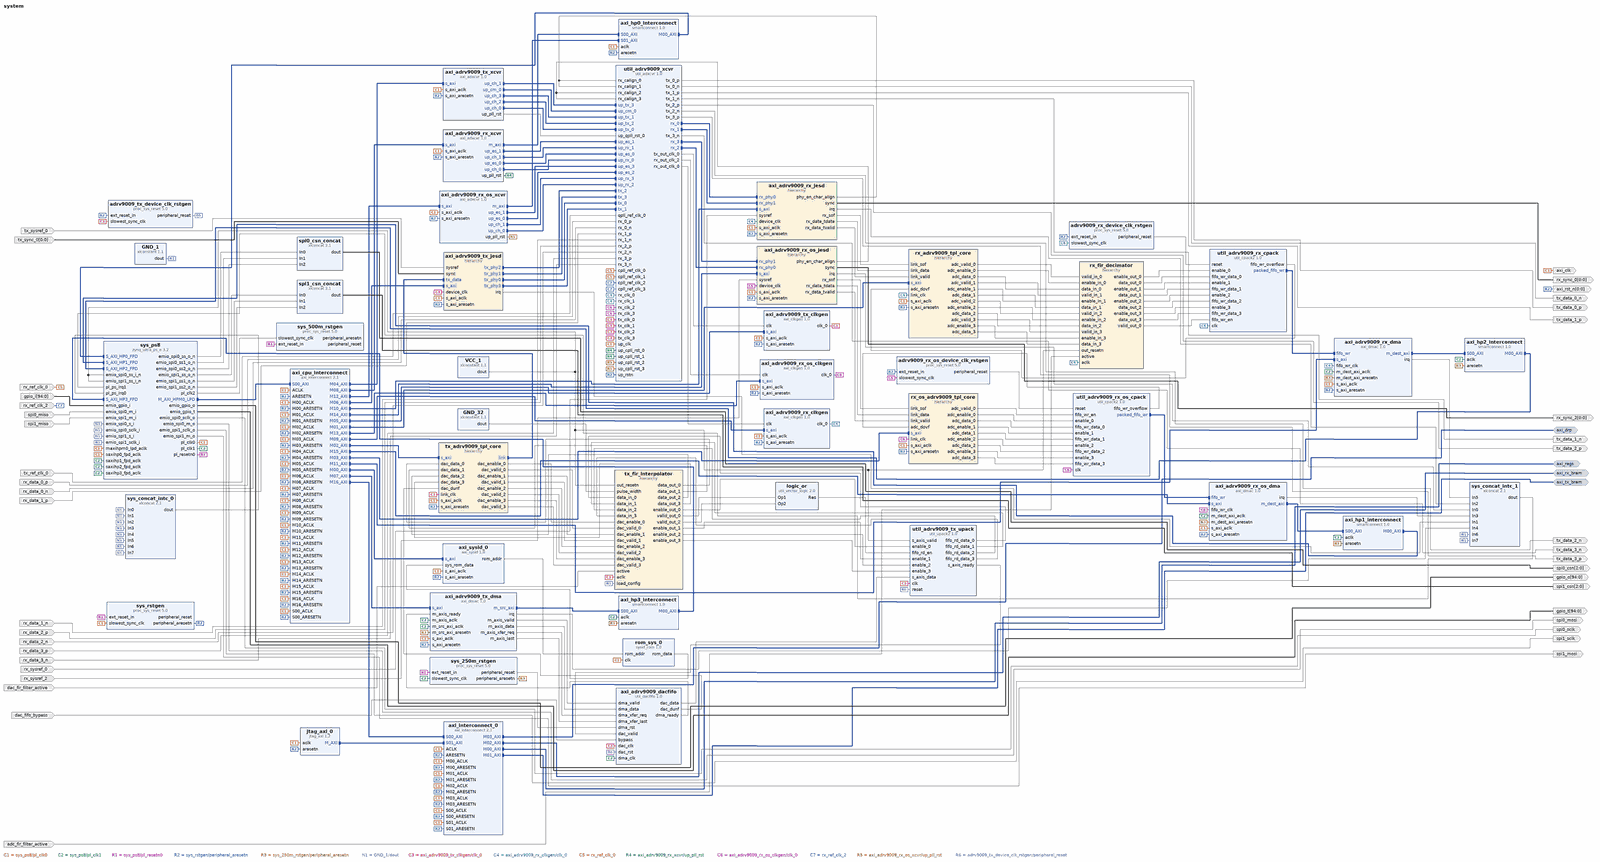
[diagram p0: block diagram of the top level, whole]
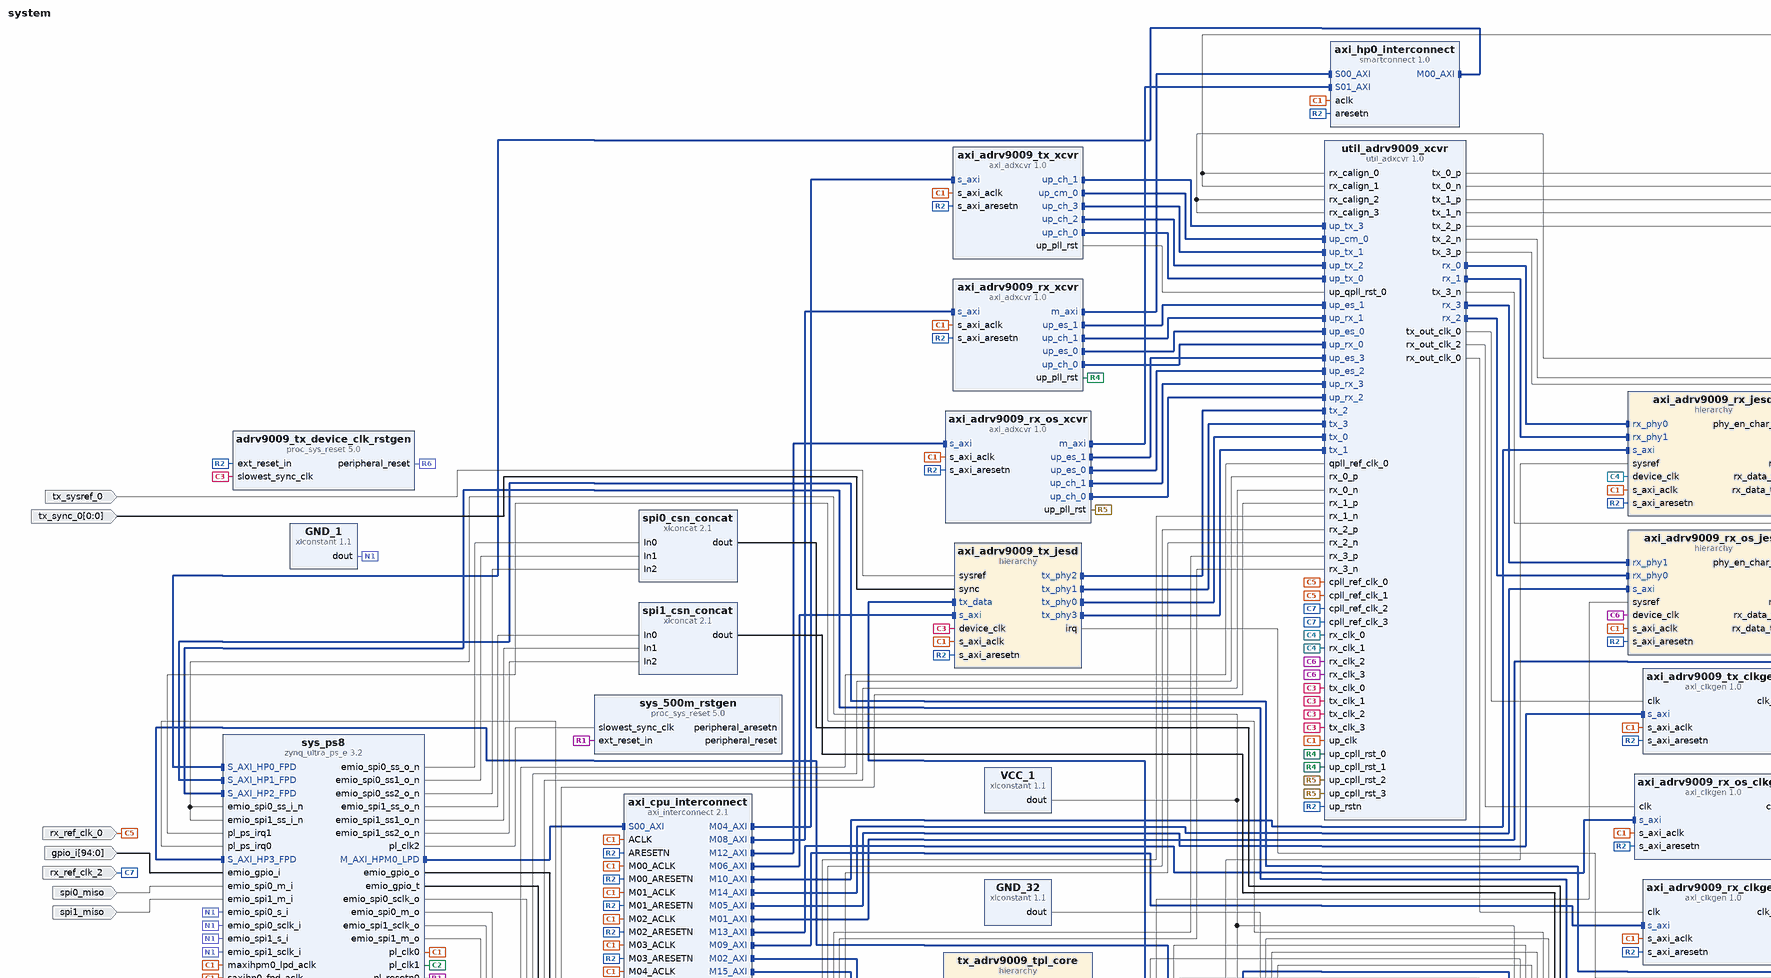
[diagram p1: block diagram of the top level, upper left part]
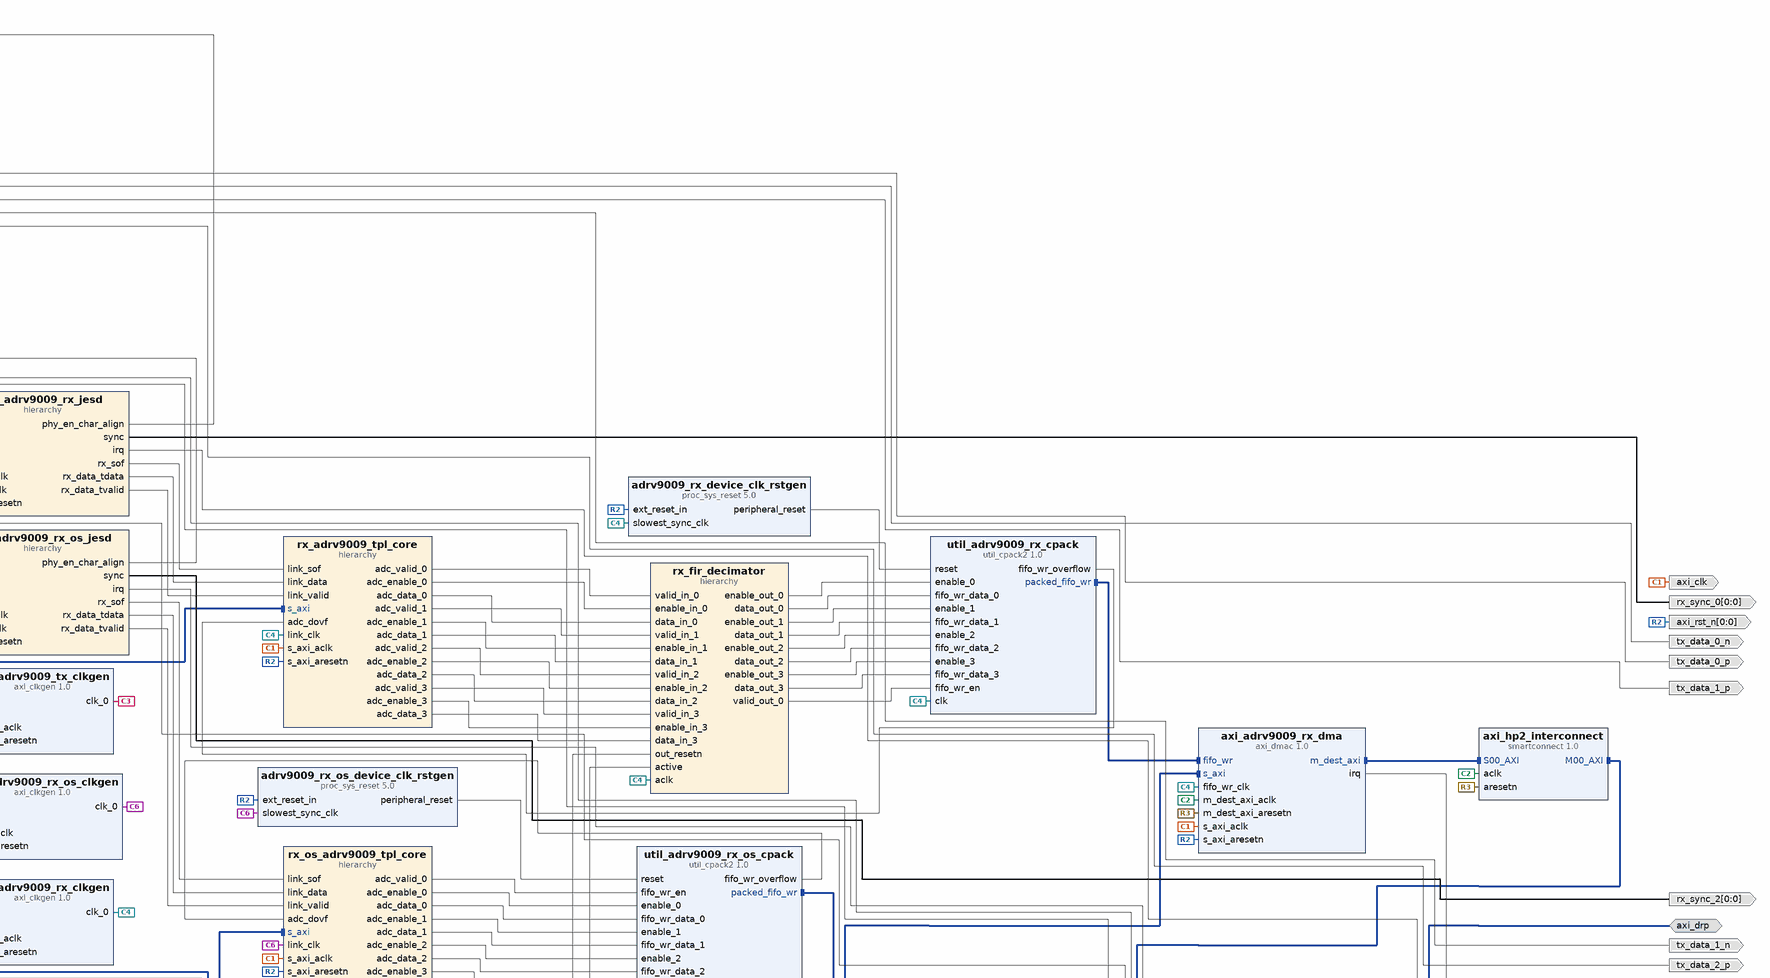
[diagram p2: block diagram of the top level, upper right part]
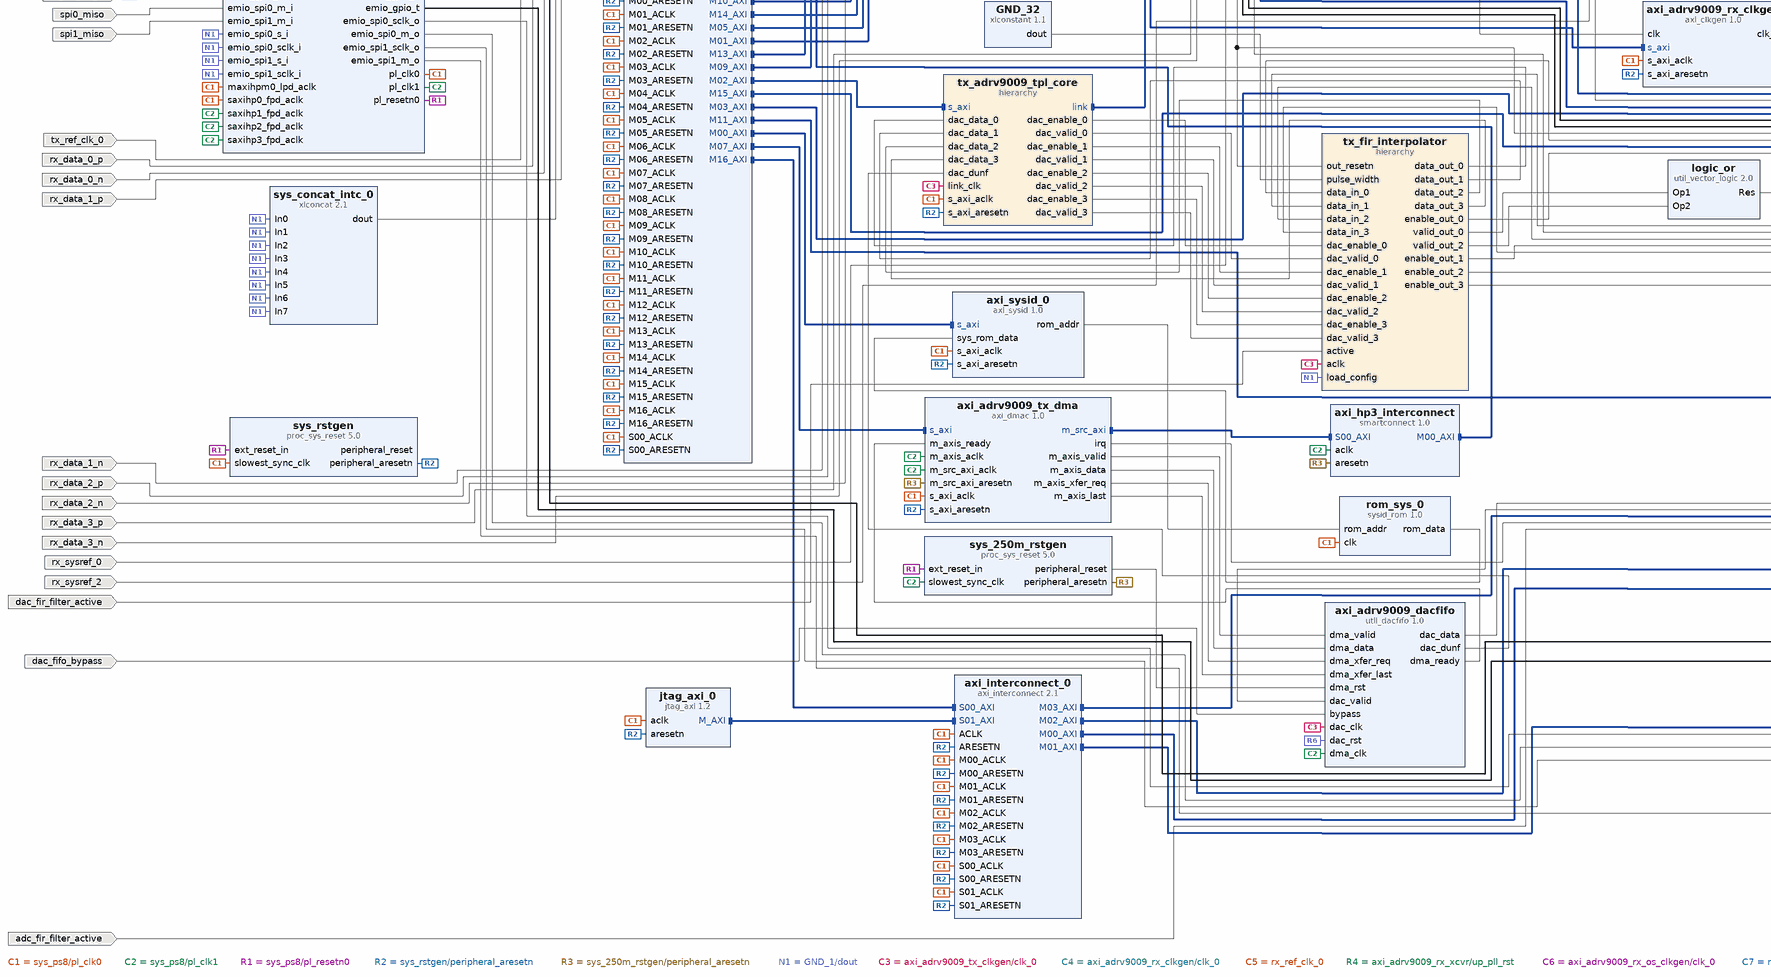
[diagram p3: block diagram of the top level, lower left part]
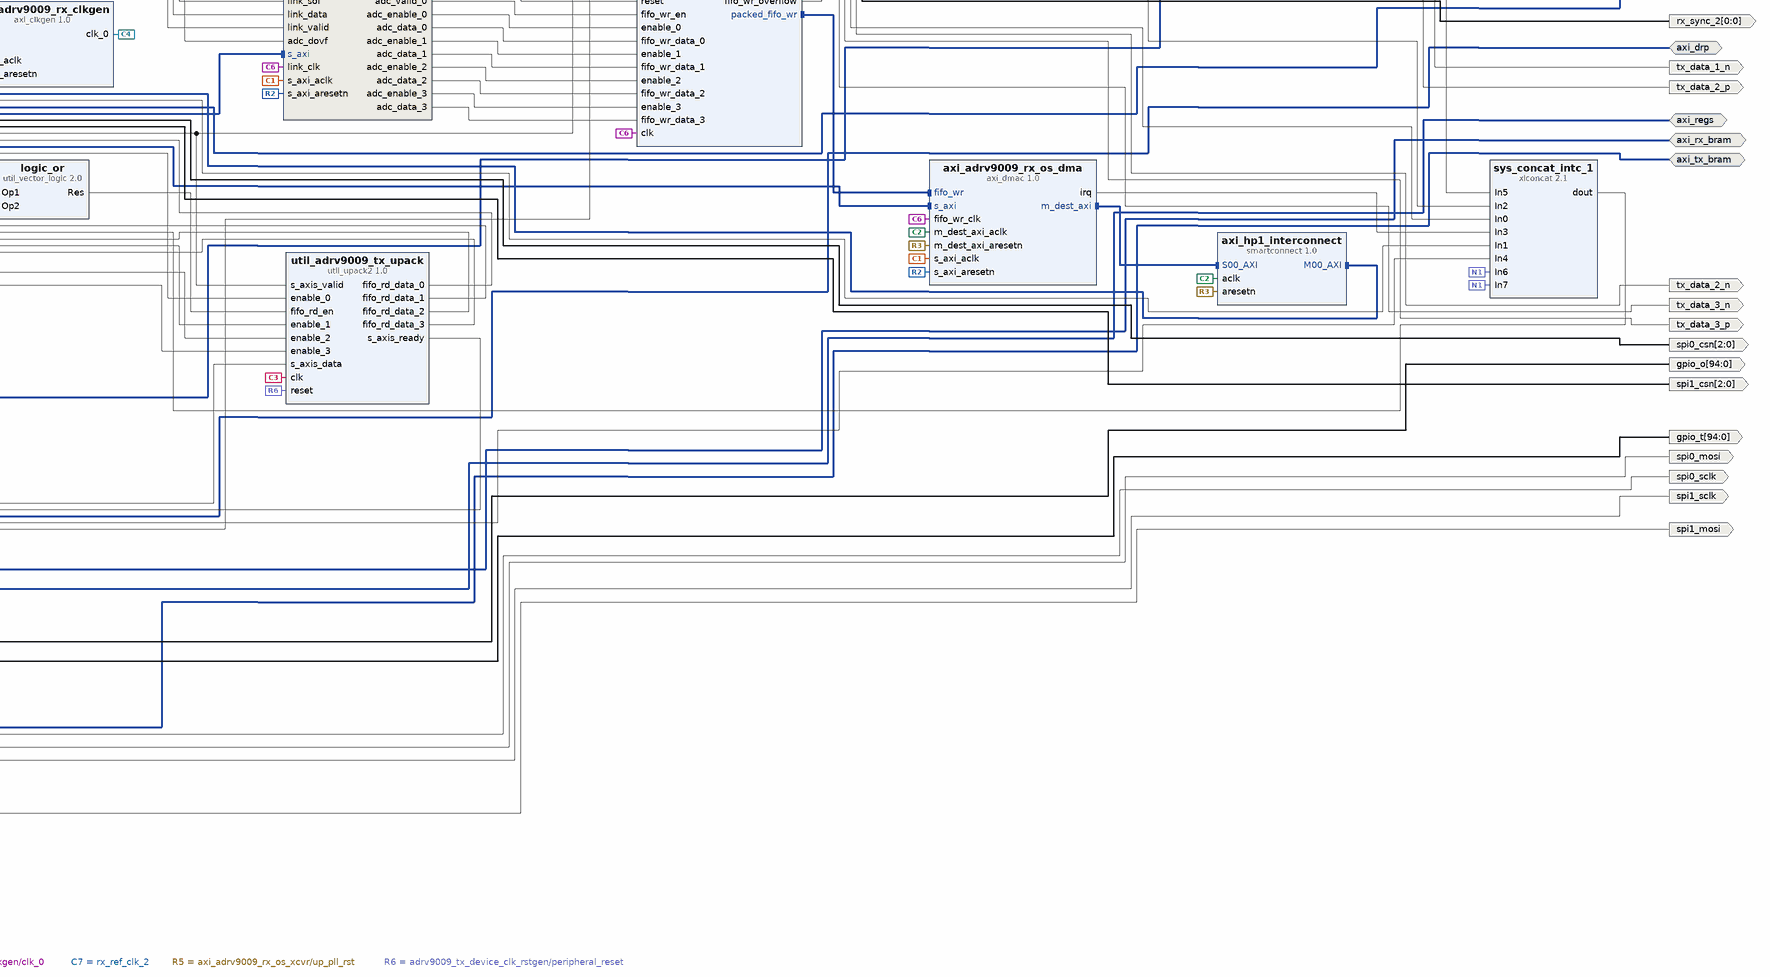
[diagram p4: block diagram of the top level, lower right part]
# Vivado block design system, xczu9eg-ffvb1156-2-e, Vivado 2018.3
create_bd_design system

create_bd_intf_port -mode Master -vlnv xilinx.com:interface:aximm_rtl:1.0 axi_tx_bram
set_property -dict [list \
  CONFIG.ADDR_WIDTH 32 \
  CONFIG.DATA_WIDTH 32 \
  CONFIG.NUM_READ_OUTSTANDING 2 \
  CONFIG.NUM_WRITE_OUTSTANDING 2 \
  CONFIG.PROTOCOL AXI4 \
] [get_bd_intf_ports axi_tx_bram]
create_bd_intf_port -mode Master -vlnv xilinx.com:interface:aximm_rtl:1.0 axi_rx_bram
set_property -dict [list \
  CONFIG.ADDR_WIDTH 32 \
  CONFIG.DATA_WIDTH 32 \
  CONFIG.NUM_READ_OUTSTANDING 2 \
  CONFIG.NUM_WRITE_OUTSTANDING 2 \
  CONFIG.PROTOCOL AXI4 \
] [get_bd_intf_ports axi_rx_bram]
create_bd_intf_port -mode Master -vlnv xilinx.com:interface:aximm_rtl:1.0 axi_regs
set_property -dict [list \
  CONFIG.ADDR_WIDTH 40 \
  CONFIG.DATA_WIDTH 32 \
  CONFIG.HAS_BURST 0 \
  CONFIG.HAS_CACHE 0 \
  CONFIG.HAS_LOCK 0 \
  CONFIG.HAS_QOS 0 \
  CONFIG.HAS_REGION 0 \
  CONFIG.NUM_READ_OUTSTANDING 2 \
  CONFIG.NUM_WRITE_OUTSTANDING 2 \
  CONFIG.PROTOCOL AXI4LITE \
] [get_bd_intf_ports axi_regs]
create_bd_intf_port -mode Master -vlnv xilinx.com:interface:aximm_rtl:1.0 axi_drp
set_property -dict [list \
  CONFIG.ADDR_WIDTH 40 \
  CONFIG.DATA_WIDTH 32 \
  CONFIG.HAS_BURST 0 \
  CONFIG.HAS_CACHE 0 \
  CONFIG.HAS_LOCK 0 \
  CONFIG.HAS_QOS 0 \
  CONFIG.HAS_REGION 0 \
  CONFIG.NUM_READ_OUTSTANDING 2 \
  CONFIG.NUM_WRITE_OUTSTANDING 2 \
  CONFIG.PROTOCOL AXI4LITE \
] [get_bd_intf_ports axi_drp]
create_bd_port -dir O -from 2 -to 0 spi0_csn
create_bd_port -dir O spi0_sclk
create_bd_port -dir O spi0_mosi
create_bd_port -dir I spi0_miso
create_bd_port -dir O -from 2 -to 0 spi1_csn
create_bd_port -dir O spi1_sclk
create_bd_port -dir O spi1_mosi
create_bd_port -dir I spi1_miso
create_bd_port -dir I -from 94 -to 0 gpio_i
create_bd_port -dir O -from 94 -to 0 gpio_o
create_bd_port -dir O -from 94 -to 0 gpio_t
create_bd_port -dir I dac_fifo_bypass
create_bd_port -dir I adc_fir_filter_active
create_bd_port -dir I dac_fir_filter_active
create_bd_port -dir I tx_ref_clk_0
create_bd_port -dir I rx_ref_clk_0
create_bd_port -dir I rx_ref_clk_2
create_bd_port -dir I tx_sysref_0
create_bd_port -dir I -from 0 -to 0 tx_sync_0
create_bd_port -dir O tx_data_0_p
create_bd_port -dir O tx_data_0_n
create_bd_port -dir O tx_data_1_p
create_bd_port -dir O tx_data_1_n
create_bd_port -dir O tx_data_2_p
create_bd_port -dir O tx_data_2_n
create_bd_port -dir O tx_data_3_p
create_bd_port -dir O tx_data_3_n
create_bd_port -dir I rx_sysref_0
create_bd_port -dir O -from 0 -to 0 rx_sync_0
create_bd_port -dir I rx_data_0_p
create_bd_port -dir I rx_data_0_n
create_bd_port -dir I rx_data_1_p
create_bd_port -dir I rx_data_1_n
create_bd_port -dir I rx_sysref_2
create_bd_port -dir O -from 0 -to 0 rx_sync_2
create_bd_port -dir I rx_data_2_p
create_bd_port -dir I rx_data_2_n
create_bd_port -dir I rx_data_3_p
create_bd_port -dir I rx_data_3_n
create_bd_port -dir O -type clk axi_clk
set_property -dict {CONFIG.ASSOCIATED_BUSIF axi_regs:axi_rx_bram:axi_tx_bram:axi_drp} [get_bd_ports axi_clk]
create_bd_port -dir O -from 0 -to 0 -type rst axi_rst_n

create_bd_cell -type ip -vlnv xilinx.com:ip:zynq_ultra_ps_e:3.2 sys_ps8
set_property -dict [list \
  CONFIG.PSU_BANK_0_IO_STANDARD LVCMOS18 \
  CONFIG.PSU_BANK_1_IO_STANDARD LVCMOS18 \
  CONFIG.PSU_BANK_2_IO_STANDARD LVCMOS18 \
  CONFIG.PSU_BANK_3_IO_STANDARD LVCMOS18 \
  CONFIG.PSU__CAN1__PERIPHERAL__ENABLE 1 \
  CONFIG.PSU__CAN1__PERIPHERAL__IO {MIO 24 .. 25} \
  CONFIG.PSU__CRF_APB__ACPU_CTRL__FREQMHZ 1200 \
  CONFIG.PSU__CRF_APB__ACPU_CTRL__SRCSEL APLL \
  CONFIG.PSU__CRF_APB__APLL_CTRL__SRCSEL PSS_REF_CLK \
  CONFIG.PSU__CRF_APB__DBG_FPD_CTRL__FREQMHZ 250 \
  CONFIG.PSU__CRF_APB__DBG_FPD_CTRL__SRCSEL IOPLL \
  CONFIG.PSU__CRF_APB__DBG_TRACE_CTRL__FREQMHZ 250 \
  CONFIG.PSU__CRF_APB__DBG_TRACE_CTRL__SRCSEL IOPLL \
  CONFIG.PSU__CRF_APB__DBG_TSTMP_CTRL__FREQMHZ 250 \
  CONFIG.PSU__CRF_APB__DBG_TSTMP_CTRL__SRCSEL IOPLL \
  CONFIG.PSU__CRF_APB__DDR_CTRL__FREQMHZ 1067 \
  CONFIG.PSU__CRF_APB__DDR_CTRL__SRCSEL DPLL \
  CONFIG.PSU__CRF_APB__DPDMA_REF_CTRL__FREQMHZ 600 \
  CONFIG.PSU__CRF_APB__DPDMA_REF_CTRL__SRCSEL APLL \
  CONFIG.PSU__CRF_APB__DPLL_CTRL__SRCSEL PSS_REF_CLK \
  CONFIG.PSU__CRF_APB__DP_AUDIO_REF_CTRL__SRCSEL RPLL \
  CONFIG.PSU__CRF_APB__DP_STC_REF_CTRL__SRCSEL RPLL \
  CONFIG.PSU__CRF_APB__DP_VIDEO_REF_CTRL__SRCSEL VPLL \
  CONFIG.PSU__CRF_APB__GDMA_REF_CTRL__FREQMHZ 600 \
  CONFIG.PSU__CRF_APB__GDMA_REF_CTRL__SRCSEL APLL \
  CONFIG.PSU__CRF_APB__GPU_REF_CTRL__FREQMHZ 500 \
  CONFIG.PSU__CRF_APB__GPU_REF_CTRL__SRCSEL IOPLL \
  CONFIG.PSU__CRF_APB__TOPSW_LSBUS_CTRL__FREQMHZ 100 \
  CONFIG.PSU__CRF_APB__TOPSW_LSBUS_CTRL__SRCSEL IOPLL \
  CONFIG.PSU__CRF_APB__TOPSW_MAIN_CTRL__FREQMHZ 533.33 \
  CONFIG.PSU__CRF_APB__TOPSW_MAIN_CTRL__SRCSEL DPLL \
  CONFIG.PSU__CRF_APB__VPLL_CTRL__SRCSEL PSS_REF_CLK \
  CONFIG.PSU__CRL_APB__ADMA_REF_CTRL__FREQMHZ 500 \
  CONFIG.PSU__CRL_APB__ADMA_REF_CTRL__SRCSEL IOPLL \
  CONFIG.PSU__CRL_APB__CAN1_REF_CTRL__FREQMHZ 100 \
  CONFIG.PSU__CRL_APB__CAN1_REF_CTRL__SRCSEL IOPLL \
  CONFIG.PSU__CRL_APB__CPU_R5_CTRL__FREQMHZ 500 \
  CONFIG.PSU__CRL_APB__CPU_R5_CTRL__SRCSEL IOPLL \
  CONFIG.PSU__CRL_APB__DBG_LPD_CTRL__FREQMHZ 250 \
  CONFIG.PSU__CRL_APB__DBG_LPD_CTRL__SRCSEL IOPLL \
  CONFIG.PSU__CRL_APB__GEM3_REF_CTRL__FREQMHZ 125 \
  CONFIG.PSU__CRL_APB__GEM3_REF_CTRL__SRCSEL IOPLL \
  CONFIG.PSU__CRL_APB__I2C0_REF_CTRL__FREQMHZ 100 \
  CONFIG.PSU__CRL_APB__I2C0_REF_CTRL__SRCSEL IOPLL \
  CONFIG.PSU__CRL_APB__I2C1_REF_CTRL__FREQMHZ 100 \
  CONFIG.PSU__CRL_APB__I2C1_REF_CTRL__SRCSEL IOPLL \
  CONFIG.PSU__CRL_APB__IOPLL_CTRL__SRCSEL PSS_REF_CLK \
  CONFIG.PSU__CRL_APB__IOU_SWITCH_CTRL__FREQMHZ 250 \
  CONFIG.PSU__CRL_APB__IOU_SWITCH_CTRL__SRCSEL IOPLL \
  CONFIG.PSU__CRL_APB__LPD_LSBUS_CTRL__FREQMHZ 100 \
  CONFIG.PSU__CRL_APB__LPD_LSBUS_CTRL__SRCSEL IOPLL \
  CONFIG.PSU__CRL_APB__LPD_SWITCH_CTRL__FREQMHZ 500 \
  CONFIG.PSU__CRL_APB__LPD_SWITCH_CTRL__SRCSEL IOPLL \
  CONFIG.PSU__CRL_APB__PCAP_CTRL__FREQMHZ 200 \
  CONFIG.PSU__CRL_APB__PCAP_CTRL__SRCSEL IOPLL \
  CONFIG.PSU__CRL_APB__PL0_REF_CTRL__FREQMHZ 100 \
  CONFIG.PSU__CRL_APB__PL0_REF_CTRL__SRCSEL IOPLL \
  CONFIG.PSU__CRL_APB__PL1_REF_CTRL__FREQMHZ 250 \
  CONFIG.PSU__CRL_APB__PL1_REF_CTRL__SRCSEL IOPLL \
  CONFIG.PSU__CRL_APB__PL2_REF_CTRL__FREQMHZ 500 \
  CONFIG.PSU__CRL_APB__PL2_REF_CTRL__SRCSEL IOPLL \
  CONFIG.PSU__CRL_APB__QSPI_REF_CTRL__FREQMHZ 125 \
  CONFIG.PSU__CRL_APB__QSPI_REF_CTRL__SRCSEL IOPLL \
  CONFIG.PSU__CRL_APB__RPLL_CTRL__SRCSEL PSS_REF_CLK \
  CONFIG.PSU__CRL_APB__SDIO1_REF_CTRL__FREQMHZ 200 \
  CONFIG.PSU__CRL_APB__SDIO1_REF_CTRL__SRCSEL IOPLL \
  CONFIG.PSU__CRL_APB__SPI0_REF_CTRL__FREQMHZ 100 \
  CONFIG.PSU__CRL_APB__SPI1_REF_CTRL__FREQMHZ 100 \
  CONFIG.PSU__CRL_APB__TIMESTAMP_REF_CTRL__FREQMHZ 100 \
  CONFIG.PSU__CRL_APB__TIMESTAMP_REF_CTRL__SRCSEL IOPLL \
  CONFIG.PSU__CRL_APB__UART0_REF_CTRL__FREQMHZ 100 \
  CONFIG.PSU__CRL_APB__UART0_REF_CTRL__SRCSEL IOPLL \
  CONFIG.PSU__CRL_APB__UART1_REF_CTRL__FREQMHZ 100 \
  CONFIG.PSU__CRL_APB__UART1_REF_CTRL__SRCSEL IOPLL \
  CONFIG.PSU__CRL_APB__USB0_BUS_REF_CTRL__FREQMHZ 250 \
  CONFIG.PSU__CRL_APB__USB0_BUS_REF_CTRL__SRCSEL IOPLL \
  CONFIG.PSU__CRL_APB__USB3_DUAL_REF_CTRL__FREQMHZ 20 \
  CONFIG.PSU__CRL_APB__USB3_DUAL_REF_CTRL__SRCSEL IOPLL \
  CONFIG.PSU__CRL_APB__USB3__ENABLE 1 \
  CONFIG.PSU__CSUPMU__PERIPHERAL__VALID 1 \
  CONFIG.PSU__DDRC__BUS_WIDTH {64 Bit} \
  CONFIG.PSU__DDRC__COMPONENTS UDIMM \
  CONFIG.PSU__DDRC__DEVICE_CAPACITY {4096 MBits} \
  CONFIG.PSU__DDRC__DRAM_WIDTH {8 Bits} \
  CONFIG.PSU__DDRC__ECC Disabled \
  CONFIG.PSU__DDRC__MEMORY_TYPE {DDR 4} \
  CONFIG.PSU__DDRC__SPEED_BIN DDR4_2133P \
  CONFIG.PSU__DDR_HIGH_ADDRESS_GUI_ENABLE 1 \
  CONFIG.PSU__DDR__INTERFACE__FREQMHZ 533.500 \
  CONFIG.PSU__DISPLAYPORT__LANE0__ENABLE 1 \
  CONFIG.PSU__DISPLAYPORT__LANE0__IO {GT Lane1} \
  CONFIG.PSU__DISPLAYPORT__LANE1__ENABLE 0 \
  CONFIG.PSU__DISPLAYPORT__PERIPHERAL__ENABLE 1 \
  CONFIG.PSU__DLL__ISUSED 1 \
  CONFIG.PSU__DPAUX__PERIPHERAL__ENABLE 1 \
  CONFIG.PSU__DPAUX__PERIPHERAL__IO {MIO 27 .. 30} \
  CONFIG.PSU__DP__LANE_SEL {Single Lower} \
  CONFIG.PSU__DP__REF_CLK_FREQ 27 \
  CONFIG.PSU__DP__REF_CLK_SEL {Ref Clk3} \
  CONFIG.PSU__ENET3__FIFO__ENABLE 0 \
  CONFIG.PSU__ENET3__GRP_MDIO__ENABLE 1 \
  CONFIG.PSU__ENET3__GRP_MDIO__IO {MIO 76 .. 77} \
  CONFIG.PSU__ENET3__PERIPHERAL__ENABLE 1 \
  CONFIG.PSU__ENET3__PERIPHERAL__IO {MIO 64 .. 75} \
  CONFIG.PSU__ENET3__PTP__ENABLE 0 \
  CONFIG.PSU__ENET3__TSU__ENABLE 0 \
  CONFIG.PSU__FPGA_PL0_ENABLE 1 \
  CONFIG.PSU__FPGA_PL1_ENABLE 1 \
  CONFIG.PSU__FPGA_PL2_ENABLE 1 \
  CONFIG.PSU__GEM3_COHERENCY 0 \
  CONFIG.PSU__GEM__TSU__ENABLE 0 \
  CONFIG.PSU__GPIO0_MIO__IO {MIO 0 .. 25} \
  CONFIG.PSU__GPIO0_MIO__PERIPHERAL__ENABLE 1 \
  CONFIG.PSU__GPIO1_MIO__IO {MIO 26 .. 51} \
  CONFIG.PSU__GPIO1_MIO__PERIPHERAL__ENABLE 1 \
  CONFIG.PSU__GPIO_EMIO_WIDTH 95 \
  CONFIG.PSU__GPIO_EMIO__PERIPHERAL__ENABLE 1 \
  CONFIG.PSU__GPIO_EMIO__PERIPHERAL__IO 95 \
  CONFIG.PSU__GT__LINK_SPEED HBR \
  CONFIG.PSU__GT__PRE_EMPH_LVL_4 0 \
  CONFIG.PSU__GT__VLT_SWNG_LVL_4 0 \
  CONFIG.PSU__I2C0__PERIPHERAL__ENABLE 1 \
  CONFIG.PSU__I2C0__PERIPHERAL__IO {MIO 14 .. 15} \
  CONFIG.PSU__I2C1__PERIPHERAL__ENABLE 1 \
  CONFIG.PSU__I2C1__PERIPHERAL__IO {MIO 16 .. 17} \
  CONFIG.PSU__IOU_SLCR__IOU_TTC_APB_CLK__TTC0_SEL APB \
  CONFIG.PSU__IOU_SLCR__IOU_TTC_APB_CLK__TTC1_SEL APB \
  CONFIG.PSU__IOU_SLCR__IOU_TTC_APB_CLK__TTC2_SEL APB \
  CONFIG.PSU__IOU_SLCR__IOU_TTC_APB_CLK__TTC3_SEL APB \
  CONFIG.PSU__OVERRIDE__BASIC_CLOCK 0 \
  CONFIG.PSU__PCIE__BAR0_VAL 0x0 \
  CONFIG.PSU__PCIE__BAR1_VAL 0x0 \
  CONFIG.PSU__PCIE__BAR2_VAL 0x0 \
  CONFIG.PSU__PCIE__BAR3_VAL 0x0 \
  CONFIG.PSU__PCIE__BAR4_VAL 0x0 \
  CONFIG.PSU__PCIE__BAR5_VAL 0x0 \
  CONFIG.PSU__PCIE__CLASS_CODE_BASE 0x06 \
  CONFIG.PSU__PCIE__CLASS_CODE_INTERFACE 0x0 \
  CONFIG.PSU__PCIE__CLASS_CODE_SUB 0x4 \
  CONFIG.PSU__PCIE__CLASS_CODE_VALUE 0x60400 \
  CONFIG.PSU__PCIE__CRS_SW_VISIBILITY 1 \
  CONFIG.PSU__PCIE__DEVICE_ID 0xD021 \
  CONFIG.PSU__PCIE__DEVICE_PORT_TYPE {Root Port} \
  CONFIG.PSU__PCIE__EROM_VAL 0x0 \
  CONFIG.PSU__PCIE__LANE0__ENABLE 1 \
  CONFIG.PSU__PCIE__LANE0__IO {GT Lane0} \
  CONFIG.PSU__PCIE__LINK_SPEED {5.0 Gb/s} \
  CONFIG.PSU__PCIE__MAXIMUM_LINK_WIDTH x1 \
  CONFIG.PSU__PCIE__MAX_PAYLOAD_SIZE {256 bytes} \
  CONFIG.PSU__PCIE__PERIPHERAL__ENABLE 1 \
  CONFIG.PSU__PCIE__PERIPHERAL__ENDPOINT_ENABLE 0 \
  CONFIG.PSU__PCIE__PERIPHERAL__ROOTPORT_ENABLE 1 \
  CONFIG.PSU__PCIE__PERIPHERAL__ROOTPORT_IO {MIO 31} \
  CONFIG.PSU__PCIE__REF_CLK_FREQ 100 \
  CONFIG.PSU__PCIE__REF_CLK_SEL {Ref Clk0} \
  CONFIG.PSU__PCIE__REVISION_ID 0x0 \
  CONFIG.PSU__PCIE__SUBSYSTEM_ID 0x7 \
  CONFIG.PSU__PCIE__SUBSYSTEM_VENDOR_ID 0x10EE \
  CONFIG.PSU__PCIE__VENDOR_ID 0x10EE \
  CONFIG.PSU__PMU_COHERENCY 0 \
  CONFIG.PSU__PMU__AIBACK__ENABLE 0 \
  CONFIG.PSU__PMU__EMIO_GPI__ENABLE 0 \
  CONFIG.PSU__PMU__EMIO_GPO__ENABLE 0 \
  CONFIG.PSU__PMU__GPI0__ENABLE 0 \
  CONFIG.PSU__PMU__GPI1__ENABLE 0 \
  CONFIG.PSU__PMU__GPI2__ENABLE 0 \
  CONFIG.PSU__PMU__GPI3__ENABLE 0 \
  CONFIG.PSU__PMU__GPI4__ENABLE 0 \
  CONFIG.PSU__PMU__GPI5__ENABLE 0 \
  CONFIG.PSU__PMU__GPO0__ENABLE 1 \
  CONFIG.PSU__PMU__GPO0__IO {MIO 32} \
  CONFIG.PSU__PMU__GPO1__ENABLE 1 \
  CONFIG.PSU__PMU__GPO1__IO {MIO 33} \
  CONFIG.PSU__PMU__GPO2__ENABLE 1 \
  CONFIG.PSU__PMU__GPO2__IO {MIO 34} \
  CONFIG.PSU__PMU__GPO2__POLARITY high \
  CONFIG.PSU__PMU__GPO3__ENABLE 1 \
  CONFIG.PSU__PMU__GPO3__IO {MIO 35} \
  CONFIG.PSU__PMU__GPO3__POLARITY low \
  CONFIG.PSU__PMU__GPO4__ENABLE 1 \
  CONFIG.PSU__PMU__GPO4__IO {MIO 36} \
  CONFIG.PSU__PMU__GPO4__POLARITY low \
  CONFIG.PSU__PMU__GPO5__ENABLE 1 \
  CONFIG.PSU__PMU__GPO5__IO {MIO 37} \
  CONFIG.PSU__PMU__GPO5__POLARITY low \
  CONFIG.PSU__PMU__PERIPHERAL__ENABLE 1 \
  CONFIG.PSU__PMU__PLERROR__ENABLE 0 \
  CONFIG.PSU__PRESET_APPLIED 1 \
  CONFIG.PSU__PSS_REF_CLK__FREQMHZ 33.330 \
  CONFIG.PSU__QSPI_COHERENCY 0 \
  CONFIG.PSU__QSPI__GRP_FBCLK__ENABLE 1 \
  CONFIG.PSU__QSPI__GRP_FBCLK__IO {MIO 6} \
  CONFIG.PSU__QSPI__PERIPHERAL__DATA_MODE x4 \
  CONFIG.PSU__QSPI__PERIPHERAL__ENABLE 1 \
  CONFIG.PSU__QSPI__PERIPHERAL__IO {MIO 0 .. 12} \
  CONFIG.PSU__QSPI__PERIPHERAL__MODE {Dual Parallel} \
  CONFIG.PSU__SATA__LANE1__IO {GT Lane3} \
  CONFIG.PSU__SATA__PERIPHERAL__ENABLE 1 \
  CONFIG.PSU__SATA__REF_CLK_FREQ 125 \
  CONFIG.PSU__SATA__REF_CLK_SEL {Ref Clk1} \
  CONFIG.PSU__SD1_COHERENCY 0 \
  CONFIG.PSU__SD1__DATA_TRANSFER_MODE 8Bit \
  CONFIG.PSU__SD1__GRP_CD__ENABLE 1 \
  CONFIG.PSU__SD1__GRP_CD__IO {MIO 45} \
  CONFIG.PSU__SD1__GRP_POW__ENABLE 0 \
  CONFIG.PSU__SD1__GRP_WP__ENABLE 1 \
  CONFIG.PSU__SD1__GRP_WP__IO {MIO 44} \
  CONFIG.PSU__SD1__PERIPHERAL__ENABLE 1 \
  CONFIG.PSU__SD1__PERIPHERAL__IO {MIO 39 .. 51} \
  CONFIG.PSU__SD1__SLOT_TYPE {SD 3.0} \
  CONFIG.PSU__SPI0__GRP_SS0__IO EMIO \
  CONFIG.PSU__SPI0__GRP_SS1__ENABLE 1 \
  CONFIG.PSU__SPI0__GRP_SS1__IO EMIO \
  CONFIG.PSU__SPI0__GRP_SS2__ENABLE 1 \
  CONFIG.PSU__SPI0__GRP_SS2__IO EMIO \
  CONFIG.PSU__SPI0__PERIPHERAL__ENABLE 1 \
  CONFIG.PSU__SPI0__PERIPHERAL__IO EMIO \
  CONFIG.PSU__SPI1__GRP_SS0__IO EMIO \
  CONFIG.PSU__SPI1__GRP_SS1__ENABLE 1 \
  CONFIG.PSU__SPI1__GRP_SS1__IO EMIO \
  CONFIG.PSU__SPI1__GRP_SS2__ENABLE 1 \
  CONFIG.PSU__SPI1__GRP_SS2__IO EMIO \
  CONFIG.PSU__SPI1__PERIPHERAL__ENABLE 1 \
  CONFIG.PSU__SPI1__PERIPHERAL__IO EMIO \
  CONFIG.PSU__SWDT0__CLOCK__ENABLE 0 \
  CONFIG.PSU__SWDT0__PERIPHERAL__ENABLE 1 \
  CONFIG.PSU__SWDT0__RESET__ENABLE 0 \
  CONFIG.PSU__SWDT1__CLOCK__ENABLE 0 \
  CONFIG.PSU__SWDT1__PERIPHERAL__ENABLE 1 \
  CONFIG.PSU__SWDT1__RESET__ENABLE 0 \
  CONFIG.PSU__TSU__BUFG_PORT_PAIR 0 \
  CONFIG.PSU__TTC0__CLOCK__ENABLE 0 \
  CONFIG.PSU__TTC0__PERIPHERAL__ENABLE 1 \
  CONFIG.PSU__TTC0__WAVEOUT__ENABLE 0 \
  CONFIG.PSU__TTC1__CLOCK__ENABLE 0 \
  CONFIG.PSU__TTC1__PERIPHERAL__ENABLE 1 \
  CONFIG.PSU__TTC1__WAVEOUT__ENABLE 0 \
  CONFIG.PSU__TTC2__CLOCK__ENABLE 0 \
  CONFIG.PSU__TTC2__PERIPHERAL__ENABLE 1 \
  CONFIG.PSU__TTC2__WAVEOUT__ENABLE 0 \
  CONFIG.PSU__TTC3__CLOCK__ENABLE 0 \
  CONFIG.PSU__TTC3__PERIPHERAL__ENABLE 1 \
  CONFIG.PSU__TTC3__WAVEOUT__ENABLE 0 \
  CONFIG.PSU__UART0__BAUD_RATE 115200 \
  CONFIG.PSU__UART0__MODEM__ENABLE 0 \
  CONFIG.PSU__UART0__PERIPHERAL__ENABLE 1 \
  CONFIG.PSU__UART0__PERIPHERAL__IO {MIO 18 .. 19} \
  CONFIG.PSU__UART1__BAUD_RATE 115200 \
  CONFIG.PSU__UART1__MODEM__ENABLE 0 \
  CONFIG.PSU__UART1__PERIPHERAL__ENABLE 1 \
  CONFIG.PSU__UART1__PERIPHERAL__IO {MIO 20 .. 21} \
  CONFIG.PSU__USB0_COHERENCY 0 \
  CONFIG.PSU__USB0__PERIPHERAL__ENABLE 1 \
  CONFIG.PSU__USB0__PERIPHERAL__IO {MIO 52 .. 63} \
  CONFIG.PSU__USB0__REF_CLK_FREQ 26 \
  CONFIG.PSU__USB0__REF_CLK_SEL {Ref Clk2} \
  CONFIG.PSU__USB2_0__EMIO__ENABLE 0 \
  CONFIG.PSU__USB3_0__EMIO__ENABLE 0 \
  CONFIG.PSU__USB3_0__PERIPHERAL__ENABLE 1 \
  CONFIG.PSU__USB3_0__PERIPHERAL__IO {GT Lane2} \
  CONFIG.PSU__USB__RESET__MODE {Boot Pin} \
  CONFIG.PSU__USB__RESET__POLARITY {Active Low} \
  CONFIG.PSU__USE__IRQ0 1 \
  CONFIG.PSU__USE__IRQ1 1 \
  CONFIG.PSU__USE__M_AXI_GP0 0 \
  CONFIG.PSU__USE__M_AXI_GP1 0 \
  CONFIG.PSU__USE__M_AXI_GP2 1 \
  CONFIG.PSU__USE__S_AXI_GP2 1 \
  CONFIG.PSU__USE__S_AXI_GP3 1 \
  CONFIG.PSU__USE__S_AXI_GP4 1 \
  CONFIG.PSU__USE__S_AXI_GP5 1 \
  CONFIG.SUBPRESET1 Custom \
] [get_bd_cells sys_ps8]
# 110 more settings of sys_ps8 are not shown: defaults, MIO pin electricals, DDR timing, and values the tool derives
create_bd_cell -type ip -vlnv xilinx.com:ip:proc_sys_reset:5.0 sys_rstgen
set_property -dict {CONFIG.C_EXT_RST_WIDTH 1} [get_bd_cells sys_rstgen]
create_bd_cell -type ip -vlnv xilinx.com:ip:proc_sys_reset:5.0 sys_250m_rstgen
set_property -dict {CONFIG.C_EXT_RST_WIDTH 1} [get_bd_cells sys_250m_rstgen]
create_bd_cell -type ip -vlnv xilinx.com:ip:proc_sys_reset:5.0 sys_500m_rstgen
set_property -dict {CONFIG.C_EXT_RST_WIDTH 1} [get_bd_cells sys_500m_rstgen]
create_bd_cell -type ip -vlnv xilinx.com:ip:xlconcat:2.1 spi0_csn_concat
set_property -dict {CONFIG.NUM_PORTS 3} [get_bd_cells spi0_csn_concat]
create_bd_cell -type ip -vlnv xilinx.com:ip:xlconstant:1.1 VCC_1
set_property -dict {CONFIG.CONST_VAL 1 CONFIG.CONST_WIDTH 1} [get_bd_cells VCC_1]
create_bd_cell -type ip -vlnv xilinx.com:ip:xlconstant:1.1 GND_1
set_property -dict {CONFIG.CONST_VAL 0 CONFIG.CONST_WIDTH 1} [get_bd_cells GND_1]
create_bd_cell -type ip -vlnv xilinx.com:ip:xlconcat:2.1 spi1_csn_concat
set_property -dict {CONFIG.NUM_PORTS 3} [get_bd_cells spi1_csn_concat]
create_bd_cell -type ip -vlnv analog.com:user:axi_sysid:1.0 axi_sysid_0
set_property -dict {CONFIG.ROM_ADDR_BITS 9} [get_bd_cells axi_sysid_0]
create_bd_cell -type ip -vlnv analog.com:user:sysid_rom:1.0 rom_sys_0
set_property -dict [list \
  CONFIG.PATH_TO_FILE c:/github/hdl/projects/adrv9009/zcu102/mem_init_sys.txt \
  CONFIG.ROM_ADDR_BITS 9 \
] [get_bd_cells rom_sys_0]
create_bd_cell -type ip -vlnv xilinx.com:ip:axi_interconnect:2.1 axi_cpu_interconnect
set_property -dict {CONFIG.NUM_MI 17} [get_bd_cells axi_cpu_interconnect]
create_bd_cell -type ip -vlnv xilinx.com:ip:xlconcat:2.1 sys_concat_intc_0
set_property -dict {CONFIG.NUM_PORTS 8} [get_bd_cells sys_concat_intc_0]
create_bd_cell -type ip -vlnv xilinx.com:ip:xlconcat:2.1 sys_concat_intc_1
set_property -dict {CONFIG.NUM_PORTS 8} [get_bd_cells sys_concat_intc_1]
create_bd_cell -type ip -vlnv xilinx.com:ip:smartconnect:1.0 axi_hp0_interconnect
set_property -dict {CONFIG.NUM_MI 1 CONFIG.NUM_SI 2} [get_bd_cells axi_hp0_interconnect]
create_bd_cell -type ip -vlnv analog.com:user:axi_clkgen:1.0 axi_adrv9009_tx_clkgen
set_property -dict [list \
  CONFIG.CLK0_DIV 4 \
  CONFIG.CLKIN_PERIOD 4 \
  CONFIG.ID 2 \
  CONFIG.VCO_DIV 1 \
  CONFIG.VCO_MUL 4 \
] [get_bd_cells axi_adrv9009_tx_clkgen]
create_bd_cell -type ip -vlnv analog.com:user:axi_adxcvr:1.0 axi_adrv9009_tx_xcvr
set_property -dict [list \
  CONFIG.NUM_OF_LANES 4 \
  CONFIG.OUT_CLK_SEL {"011"} \
  CONFIG.QPLL_ENABLE 1 \
  CONFIG.SYS_CLK_SEL {"11"} \
  CONFIG.TX_OR_RX_N 1 \
] [get_bd_cells axi_adrv9009_tx_xcvr]
create_bd_cell -type hier axi_adrv9009_tx_jesd
create_bd_cell -type ip -vlnv analog.com:user:util_upack2:1.0 util_adrv9009_tx_upack
set_property -dict [list \
  CONFIG.NUM_OF_CHANNELS 4 \
  CONFIG.SAMPLES_PER_CHANNEL 2 \
  CONFIG.SAMPLE_DATA_WIDTH 16 \
] [get_bd_cells util_adrv9009_tx_upack]
create_bd_cell -type hier tx_fir_interpolator
create_bd_cell -type ip -vlnv xilinx.com:ip:xlconstant:1.1 GND_32
set_property -dict {CONFIG.CONST_VAL 0 CONFIG.CONST_WIDTH 32} [get_bd_cells GND_32]
create_bd_cell -type hier tx_adrv9009_tpl_core
create_bd_cell -type ip -vlnv analog.com:user:axi_dmac:1.0 axi_adrv9009_tx_dma
set_property -dict [list \
  CONFIG.ASYNC_CLK_DEST_REQ true \
  CONFIG.ASYNC_CLK_REQ_SRC true \
  CONFIG.ASYNC_CLK_SRC_DEST true \
  CONFIG.AXI_SLICE_DEST true \
  CONFIG.AXI_SLICE_SRC true \
  CONFIG.CYCLIC true \
  CONFIG.DMA_2D_TRANSFER false \
  CONFIG.DMA_DATA_WIDTH_DEST 128 \
  CONFIG.DMA_DATA_WIDTH_SRC 128 \
  CONFIG.DMA_TYPE_DEST 1 \
  CONFIG.DMA_TYPE_SRC 0 \
  CONFIG.FIFO_SIZE 32 \
  CONFIG.MAX_BYTES_PER_BURST 256 \
] [get_bd_cells axi_adrv9009_tx_dma]
create_bd_cell -type ip -vlnv analog.com:user:util_dacfifo:1.0 axi_adrv9009_dacfifo
set_property -dict {CONFIG.ADDRESS_WIDTH 17 CONFIG.DATA_WIDTH 128} [get_bd_cells axi_adrv9009_dacfifo]
create_bd_cell -type ip -vlnv analog.com:user:axi_clkgen:1.0 axi_adrv9009_rx_clkgen
set_property -dict [list \
  CONFIG.CLK0_DIV 4 \
  CONFIG.CLKIN_PERIOD 4 \
  CONFIG.ID 2 \
  CONFIG.VCO_DIV 1 \
  CONFIG.VCO_MUL 4 \
] [get_bd_cells axi_adrv9009_rx_clkgen]
create_bd_cell -type ip -vlnv analog.com:user:axi_adxcvr:1.0 axi_adrv9009_rx_xcvr
set_property -dict [list \
  CONFIG.NUM_OF_LANES 2 \
  CONFIG.OUT_CLK_SEL {"011"} \
  CONFIG.QPLL_ENABLE 0 \
  CONFIG.SYS_CLK_SEL 00 \
  CONFIG.TX_OR_RX_N 0 \
] [get_bd_cells axi_adrv9009_rx_xcvr]
create_bd_cell -type hier axi_adrv9009_rx_jesd
create_bd_cell -type ip -vlnv analog.com:user:util_cpack2:1.0 util_adrv9009_rx_cpack
set_property -dict [list \
  CONFIG.NUM_OF_CHANNELS 4 \
  CONFIG.SAMPLES_PER_CHANNEL 1 \
  CONFIG.SAMPLE_DATA_WIDTH 16 \
] [get_bd_cells util_adrv9009_rx_cpack]
create_bd_cell -type hier rx_adrv9009_tpl_core
create_bd_cell -type hier rx_fir_decimator
create_bd_cell -type ip -vlnv analog.com:user:axi_dmac:1.0 axi_adrv9009_rx_dma
set_property -dict [list \
  CONFIG.ASYNC_CLK_DEST_REQ true \
  CONFIG.ASYNC_CLK_REQ_SRC true \
  CONFIG.ASYNC_CLK_SRC_DEST true \
  CONFIG.AXI_SLICE_DEST true \
  CONFIG.AXI_SLICE_SRC true \
  CONFIG.CYCLIC false \
  CONFIG.DMA_2D_TRANSFER false \
  CONFIG.DMA_DATA_WIDTH_DEST 128 \
  CONFIG.DMA_DATA_WIDTH_SRC 64 \
  CONFIG.DMA_TYPE_DEST 0 \
  CONFIG.DMA_TYPE_SRC 2 \
  CONFIG.FIFO_SIZE 32 \
  CONFIG.MAX_BYTES_PER_BURST 256 \
  CONFIG.SYNC_TRANSFER_START true \
] [get_bd_cells axi_adrv9009_rx_dma]
create_bd_cell -type ip -vlnv analog.com:user:axi_clkgen:1.0 axi_adrv9009_rx_os_clkgen
set_property -dict [list \
  CONFIG.CLK0_DIV 4 \
  CONFIG.CLKIN_PERIOD 4 \
  CONFIG.ID 2 \
  CONFIG.VCO_DIV 1 \
  CONFIG.VCO_MUL 4 \
] [get_bd_cells axi_adrv9009_rx_os_clkgen]
create_bd_cell -type ip -vlnv analog.com:user:axi_adxcvr:1.0 axi_adrv9009_rx_os_xcvr
set_property -dict [list \
  CONFIG.NUM_OF_LANES 2 \
  CONFIG.OUT_CLK_SEL {"011"} \
  CONFIG.QPLL_ENABLE 0 \
  CONFIG.SYS_CLK_SEL 00 \
  CONFIG.TX_OR_RX_N 0 \
] [get_bd_cells axi_adrv9009_rx_os_xcvr]
create_bd_cell -type hier axi_adrv9009_rx_os_jesd
create_bd_cell -type ip -vlnv analog.com:user:util_cpack2:1.0 util_adrv9009_rx_os_cpack
set_property -dict [list \
  CONFIG.NUM_OF_CHANNELS 4 \
  CONFIG.SAMPLES_PER_CHANNEL 1 \
  CONFIG.SAMPLE_DATA_WIDTH 16 \
] [get_bd_cells util_adrv9009_rx_os_cpack]
create_bd_cell -type hier rx_os_adrv9009_tpl_core
create_bd_cell -type ip -vlnv analog.com:user:axi_dmac:1.0 axi_adrv9009_rx_os_dma
set_property -dict [list \
  CONFIG.ASYNC_CLK_DEST_REQ true \
  CONFIG.ASYNC_CLK_REQ_SRC true \
  CONFIG.ASYNC_CLK_SRC_DEST true \
  CONFIG.AXI_SLICE_DEST true \
  CONFIG.AXI_SLICE_SRC true \
  CONFIG.CYCLIC false \
  CONFIG.DMA_2D_TRANSFER false \
  CONFIG.DMA_DATA_WIDTH_DEST 128 \
  CONFIG.DMA_DATA_WIDTH_SRC 64 \
  CONFIG.DMA_TYPE_DEST 0 \
  CONFIG.DMA_TYPE_SRC 2 \
  CONFIG.FIFO_SIZE 32 \
  CONFIG.MAX_BYTES_PER_BURST 256 \
  CONFIG.SYNC_TRANSFER_START true \
] [get_bd_cells axi_adrv9009_rx_os_dma]
create_bd_cell -type ip -vlnv analog.com:user:util_adxcvr:1.0 util_adrv9009_xcvr
set_property -dict [list \
  CONFIG.CPLL_FBDIV 4 \
  CONFIG.CPLL_FBDIV_4_5 5 \
  CONFIG.QPLL_FBDIV {"0001010000"} \
  CONFIG.QPLL_REFCLK_DIV 1 \
  CONFIG.RX_CDR_CFG 0x0b000023ff10400020 \
  CONFIG.RX_CLK25_DIV 10 \
  CONFIG.RX_NUM_OF_LANES 4 \
  CONFIG.RX_PMA_CFG 0x001E7080 \
  CONFIG.TX_CLK25_DIV 10 \
  CONFIG.TX_NUM_OF_LANES 4 \
  CONFIG.TX_OUT_DIV 1 \
] [get_bd_cells util_adrv9009_xcvr]
create_bd_cell -type ip -vlnv xilinx.com:ip:proc_sys_reset:5.0 adrv9009_tx_device_clk_rstgen
create_bd_cell -type ip -vlnv xilinx.com:ip:proc_sys_reset:5.0 adrv9009_rx_device_clk_rstgen
create_bd_cell -type ip -vlnv xilinx.com:ip:proc_sys_reset:5.0 adrv9009_rx_os_device_clk_rstgen
create_bd_cell -type ip -vlnv xilinx.com:ip:util_vector_logic:2.0 logic_or
set_property -dict {CONFIG.C_OPERATION or CONFIG.C_SIZE 1} [get_bd_cells logic_or]
create_bd_cell -type ip -vlnv xilinx.com:ip:smartconnect:1.0 axi_hp1_interconnect
set_property -dict {CONFIG.NUM_MI 1 CONFIG.NUM_SI 1} [get_bd_cells axi_hp1_interconnect]
create_bd_cell -type ip -vlnv xilinx.com:ip:smartconnect:1.0 axi_hp2_interconnect
set_property -dict {CONFIG.NUM_MI 1 CONFIG.NUM_SI 1} [get_bd_cells axi_hp2_interconnect]
create_bd_cell -type ip -vlnv xilinx.com:ip:smartconnect:1.0 axi_hp3_interconnect
set_property -dict {CONFIG.NUM_MI 1 CONFIG.NUM_SI 1} [get_bd_cells axi_hp3_interconnect]
create_bd_cell -type ip -vlnv xilinx.com:ip:axi_interconnect:2.1 axi_interconnect_0
set_property -dict {CONFIG.NUM_MI 4 CONFIG.NUM_SI 2} [get_bd_cells axi_interconnect_0]
create_bd_cell -type ip -vlnv xilinx.com:ip:jtag_axi:1.2 jtag_axi_0

# ---- hierarchy /axi_adrv9009_tx_jesd ----
current_bd_instance /axi_adrv9009_tx_jesd
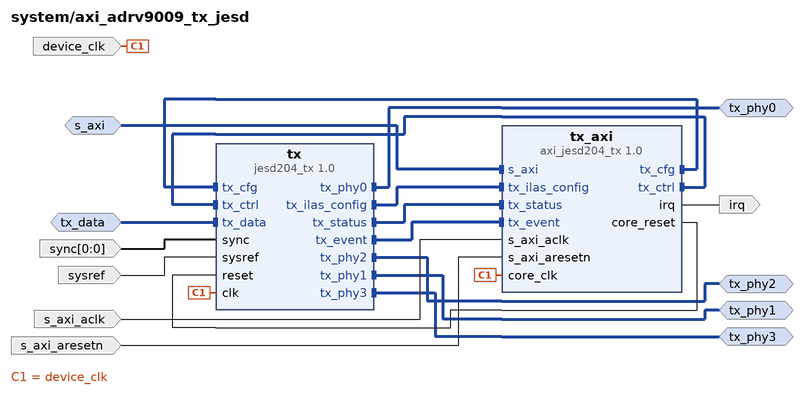
[diagram p5: block diagram inside /axi_adrv9009_tx_jesd]
create_bd_intf_pin -mode Slave -vlnv xilinx.com:interface:aximm_rtl:1.0 s_axi
create_bd_intf_pin -mode Slave -vlnv xilinx.com:interface:axis_rtl:1.0 tx_data
create_bd_intf_pin -mode Master -vlnv xilinx.com:display_jesd204:jesd204_tx_bus_rtl:1.0 tx_phy0
create_bd_intf_pin -mode Master -vlnv xilinx.com:display_jesd204:jesd204_tx_bus_rtl:1.0 tx_phy1
create_bd_intf_pin -mode Master -vlnv xilinx.com:display_jesd204:jesd204_tx_bus_rtl:1.0 tx_phy2
create_bd_intf_pin -mode Master -vlnv xilinx.com:display_jesd204:jesd204_tx_bus_rtl:1.0 tx_phy3
create_bd_pin -dir I -type clk s_axi_aclk
create_bd_pin -dir I -type rst s_axi_aresetn
create_bd_pin -dir O -type intr irq
create_bd_pin -dir I -type clk device_clk
create_bd_pin -dir I -from 0 -to 0 sync
create_bd_pin -dir I sysref

create_bd_cell -type ip -vlnv analog.com:user:axi_jesd204_tx:1.0 tx_axi
set_property -dict {CONFIG.NUM_LANES 4 CONFIG.NUM_LINKS 1} [get_bd_cells tx_axi]
create_bd_cell -type ip -vlnv analog.com:user:jesd204_tx:1.0 tx
set_property -dict {CONFIG.NUM_LANES 4 CONFIG.NUM_LINKS 1} [get_bd_cells tx]

# ---- hierarchy /tx_fir_interpolator ----
current_bd_instance /tx_fir_interpolator
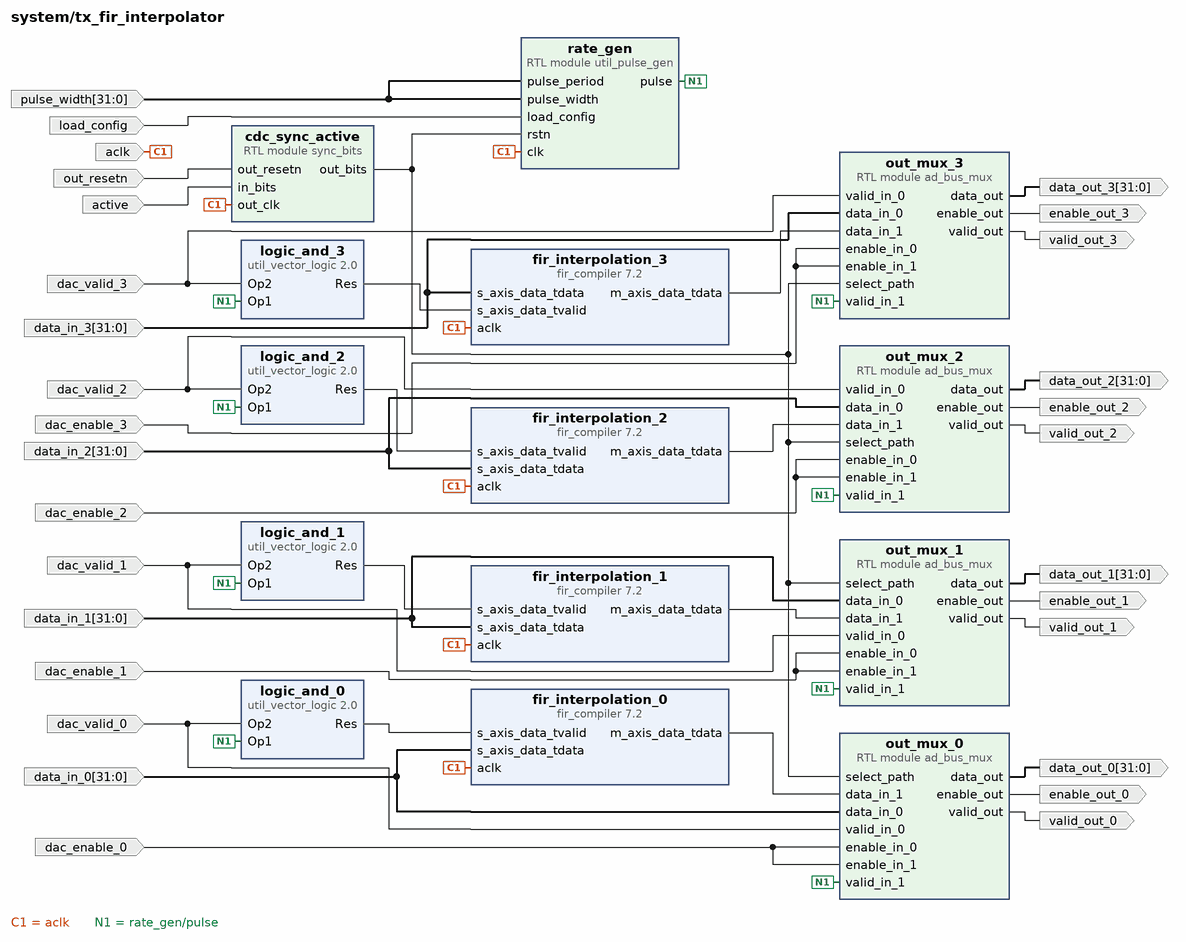
[diagram p6: block diagram inside /tx_fir_interpolator]
create_bd_pin -dir I aclk
create_bd_pin -dir I active
create_bd_pin -dir I -type rst out_resetn
create_bd_pin -dir I -from 31 -to 0 pulse_width
create_bd_pin -dir I load_config
create_bd_pin -dir I dac_valid_0
create_bd_pin -dir I dac_enable_0
create_bd_pin -dir O valid_out_0
create_bd_pin -dir O enable_out_0
create_bd_pin -dir I -from 31 -to 0 data_in_0
create_bd_pin -dir O -from 31 -to 0 data_out_0
create_bd_pin -dir I dac_valid_1
create_bd_pin -dir I dac_enable_1
create_bd_pin -dir O valid_out_1
create_bd_pin -dir O enable_out_1
create_bd_pin -dir I -from 31 -to 0 data_in_1
create_bd_pin -dir O -from 31 -to 0 data_out_1
create_bd_pin -dir I dac_valid_2
create_bd_pin -dir I dac_enable_2
create_bd_pin -dir O valid_out_2
create_bd_pin -dir O enable_out_2
create_bd_pin -dir I -from 31 -to 0 data_in_2
create_bd_pin -dir O -from 31 -to 0 data_out_2
create_bd_pin -dir I dac_valid_3
create_bd_pin -dir I dac_enable_3
create_bd_pin -dir O valid_out_3
create_bd_pin -dir O enable_out_3
create_bd_pin -dir I -from 31 -to 0 data_in_3
create_bd_pin -dir O -from 31 -to 0 data_out_3

create_bd_cell -type module -reference sync_bits cdc_sync_active
create_bd_cell -type module -reference util_pulse_gen rate_gen
set_property -dict {CONFIG.PULSE_PERIOD 7 CONFIG.PULSE_WIDTH 1} [get_bd_cells rate_gen]
create_bd_cell -type ip -vlnv xilinx.com:ip:fir_compiler:7.2 fir_interpolation_0
set_property -dict [list \
  CONFIG.Clock_Frequency 122.88 \
  CONFIG.CoefficientSource COE_File \
  CONFIG.Coefficient_File ../../../../imports/hdl/library/util_fir_int/coefile_int.coe \
  CONFIG.Coefficient_Fractional_Bits 0 \
  CONFIG.Coefficient_Sets 1 \
  CONFIG.Coefficient_Sign Signed \
  CONFIG.Coefficient_Structure Inferred \
  CONFIG.Coefficient_Width 16 \
  CONFIG.ColumnConfig 9 \
  CONFIG.Data_Fractional_Bits 15 \
  CONFIG.Decimation_Rate 1 \
  CONFIG.Filter_Architecture Systolic_Multiply_Accumulate \
  CONFIG.Filter_Type Interpolation \
  CONFIG.Interpolation_Rate 8 \
  CONFIG.Number_Channels 1 \
  CONFIG.Number_Paths 2 \
  CONFIG.Output_Rounding_Mode Symmetric_Rounding_to_Zero \
  CONFIG.Output_Width 16 \
  CONFIG.Quantization Integer_Coefficients \
  CONFIG.RateSpecification Frequency_Specification \
  CONFIG.Sample_Frequency 15.36 \
  CONFIG.Zero_Pack_Factor 1 \
] [get_bd_cells fir_interpolation_0]
create_bd_cell -type ip -vlnv xilinx.com:ip:util_vector_logic:2.0 logic_and_0
set_property -dict {CONFIG.C_SIZE 1} [get_bd_cells logic_and_0]
create_bd_cell -type module -reference ad_bus_mux out_mux_0
set_property -dict {CONFIG.DATA_WIDTH 32} [get_bd_cells out_mux_0]
create_bd_cell -type ip -vlnv xilinx.com:ip:fir_compiler:7.2 fir_interpolation_1
set_property -dict [list \
  CONFIG.Clock_Frequency 122.88 \
  CONFIG.CoefficientSource COE_File \
  CONFIG.Coefficient_File ../../../../imports/hdl/library/util_fir_int/coefile_int.coe \
  CONFIG.Coefficient_Fractional_Bits 0 \
  CONFIG.Coefficient_Sets 1 \
  CONFIG.Coefficient_Sign Signed \
  CONFIG.Coefficient_Structure Inferred \
  CONFIG.Coefficient_Width 16 \
  CONFIG.ColumnConfig 9 \
  CONFIG.Data_Fractional_Bits 15 \
  CONFIG.Decimation_Rate 1 \
  CONFIG.Filter_Architecture Systolic_Multiply_Accumulate \
  CONFIG.Filter_Type Interpolation \
  CONFIG.Interpolation_Rate 8 \
  CONFIG.Number_Channels 1 \
  CONFIG.Number_Paths 2 \
  CONFIG.Output_Rounding_Mode Symmetric_Rounding_to_Zero \
  CONFIG.Output_Width 16 \
  CONFIG.Quantization Integer_Coefficients \
  CONFIG.RateSpecification Frequency_Specification \
  CONFIG.Sample_Frequency 15.36 \
  CONFIG.Zero_Pack_Factor 1 \
] [get_bd_cells fir_interpolation_1]
create_bd_cell -type ip -vlnv xilinx.com:ip:util_vector_logic:2.0 logic_and_1
set_property -dict {CONFIG.C_SIZE 1} [get_bd_cells logic_and_1]
create_bd_cell -type module -reference ad_bus_mux out_mux_1
set_property -dict {CONFIG.DATA_WIDTH 32} [get_bd_cells out_mux_1]
create_bd_cell -type ip -vlnv xilinx.com:ip:fir_compiler:7.2 fir_interpolation_2
set_property -dict [list \
  CONFIG.Clock_Frequency 122.88 \
  CONFIG.CoefficientSource COE_File \
  CONFIG.Coefficient_File ../../../../imports/hdl/library/util_fir_int/coefile_int.coe \
  CONFIG.Coefficient_Fractional_Bits 0 \
  CONFIG.Coefficient_Sets 1 \
  CONFIG.Coefficient_Sign Signed \
  CONFIG.Coefficient_Structure Inferred \
  CONFIG.Coefficient_Width 16 \
  CONFIG.ColumnConfig 9 \
  CONFIG.Data_Fractional_Bits 15 \
  CONFIG.Decimation_Rate 1 \
  CONFIG.Filter_Architecture Systolic_Multiply_Accumulate \
  CONFIG.Filter_Type Interpolation \
  CONFIG.Interpolation_Rate 8 \
  CONFIG.Number_Channels 1 \
  CONFIG.Number_Paths 2 \
  CONFIG.Output_Rounding_Mode Symmetric_Rounding_to_Zero \
  CONFIG.Output_Width 16 \
  CONFIG.Quantization Integer_Coefficients \
  CONFIG.RateSpecification Frequency_Specification \
  CONFIG.Sample_Frequency 15.36 \
  CONFIG.Zero_Pack_Factor 1 \
] [get_bd_cells fir_interpolation_2]
create_bd_cell -type ip -vlnv xilinx.com:ip:util_vector_logic:2.0 logic_and_2
set_property -dict {CONFIG.C_SIZE 1} [get_bd_cells logic_and_2]
create_bd_cell -type module -reference ad_bus_mux out_mux_2
set_property -dict {CONFIG.DATA_WIDTH 32} [get_bd_cells out_mux_2]
create_bd_cell -type ip -vlnv xilinx.com:ip:fir_compiler:7.2 fir_interpolation_3
set_property -dict [list \
  CONFIG.Clock_Frequency 122.88 \
  CONFIG.CoefficientSource COE_File \
  CONFIG.Coefficient_File ../../../../imports/hdl/library/util_fir_int/coefile_int.coe \
  CONFIG.Coefficient_Fractional_Bits 0 \
  CONFIG.Coefficient_Sets 1 \
  CONFIG.Coefficient_Sign Signed \
  CONFIG.Coefficient_Structure Inferred \
  CONFIG.Coefficient_Width 16 \
  CONFIG.ColumnConfig 9 \
  CONFIG.Data_Fractional_Bits 15 \
  CONFIG.Decimation_Rate 1 \
  CONFIG.Filter_Architecture Systolic_Multiply_Accumulate \
  CONFIG.Filter_Type Interpolation \
  CONFIG.Interpolation_Rate 8 \
  CONFIG.Number_Channels 1 \
  CONFIG.Number_Paths 2 \
  CONFIG.Output_Rounding_Mode Symmetric_Rounding_to_Zero \
  CONFIG.Output_Width 16 \
  CONFIG.Quantization Integer_Coefficients \
  CONFIG.RateSpecification Frequency_Specification \
  CONFIG.Sample_Frequency 15.36 \
  CONFIG.Zero_Pack_Factor 1 \
] [get_bd_cells fir_interpolation_3]
create_bd_cell -type ip -vlnv xilinx.com:ip:util_vector_logic:2.0 logic_and_3
set_property -dict {CONFIG.C_SIZE 1} [get_bd_cells logic_and_3]
create_bd_cell -type module -reference ad_bus_mux out_mux_3
set_property -dict {CONFIG.DATA_WIDTH 32} [get_bd_cells out_mux_3]

# ---- hierarchy /tx_adrv9009_tpl_core ----
current_bd_instance /tx_adrv9009_tpl_core
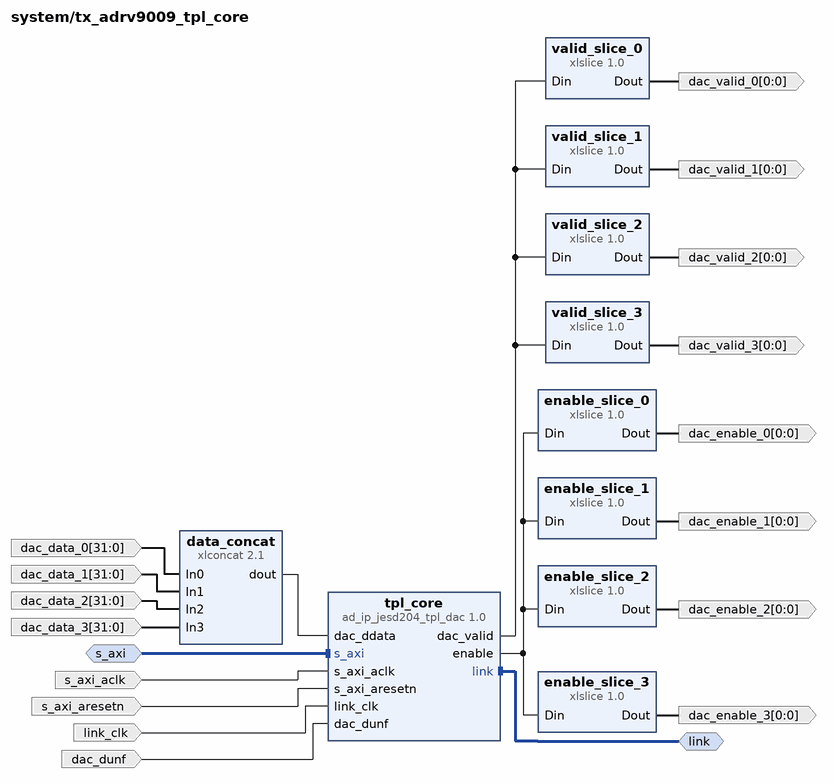
[diagram p7: block diagram inside /tx_adrv9009_tpl_core]
create_bd_intf_pin -mode Slave -vlnv xilinx.com:interface:aximm_rtl:1.0 s_axi
create_bd_intf_pin -mode Master -vlnv xilinx.com:interface:axis_rtl:1.0 link
create_bd_pin -dir I -type clk s_axi_aclk
create_bd_pin -dir I -type rst s_axi_aresetn
create_bd_pin -dir I -type clk link_clk
create_bd_pin -dir I dac_dunf
create_bd_pin -dir O -from 0 -to 0 dac_enable_0
create_bd_pin -dir O -from 0 -to 0 dac_valid_0
create_bd_pin -dir I -from 31 -to 0 dac_data_0
create_bd_pin -dir O -from 0 -to 0 dac_enable_1
create_bd_pin -dir O -from 0 -to 0 dac_valid_1
create_bd_pin -dir I -from 31 -to 0 dac_data_1
create_bd_pin -dir O -from 0 -to 0 dac_enable_2
create_bd_pin -dir O -from 0 -to 0 dac_valid_2
create_bd_pin -dir I -from 31 -to 0 dac_data_2
create_bd_pin -dir O -from 0 -to 0 dac_enable_3
create_bd_pin -dir O -from 0 -to 0 dac_valid_3
create_bd_pin -dir I -from 31 -to 0 dac_data_3

create_bd_cell -type ip -vlnv analog.com:user:ad_ip_jesd204_tpl_dac:1.0 tpl_core
set_property -dict [list \
  CONFIG.BITS_PER_SAMPLE 16 \
  CONFIG.CONVERTER_RESOLUTION 16 \
  CONFIG.NUM_CHANNELS 4 \
  CONFIG.NUM_LANES 4 \
  CONFIG.OCTETS_PER_BEAT 4 \
  CONFIG.SAMPLES_PER_FRAME 1 \
] [get_bd_cells tpl_core]
create_bd_cell -type ip -vlnv xilinx.com:ip:xlconcat:2.1 data_concat
set_property -dict {CONFIG.NUM_PORTS 4} [get_bd_cells data_concat]
create_bd_cell -type ip -vlnv xilinx.com:ip:xlslice:1.0 enable_slice_0
set_property -dict {CONFIG.DIN_FROM 0 CONFIG.DIN_TO 0 CONFIG.DIN_WIDTH 4} [get_bd_cells enable_slice_0]
create_bd_cell -type ip -vlnv xilinx.com:ip:xlslice:1.0 valid_slice_0
set_property -dict {CONFIG.DIN_FROM 0 CONFIG.DIN_TO 0 CONFIG.DIN_WIDTH 4} [get_bd_cells valid_slice_0]
create_bd_cell -type ip -vlnv xilinx.com:ip:xlslice:1.0 enable_slice_1
set_property -dict {CONFIG.DIN_FROM 1 CONFIG.DIN_TO 1 CONFIG.DIN_WIDTH 4} [get_bd_cells enable_slice_1]
create_bd_cell -type ip -vlnv xilinx.com:ip:xlslice:1.0 valid_slice_1
set_property -dict {CONFIG.DIN_FROM 1 CONFIG.DIN_TO 1 CONFIG.DIN_WIDTH 4} [get_bd_cells valid_slice_1]
create_bd_cell -type ip -vlnv xilinx.com:ip:xlslice:1.0 enable_slice_2
set_property -dict {CONFIG.DIN_FROM 2 CONFIG.DIN_TO 2 CONFIG.DIN_WIDTH 4} [get_bd_cells enable_slice_2]
create_bd_cell -type ip -vlnv xilinx.com:ip:xlslice:1.0 valid_slice_2
set_property -dict {CONFIG.DIN_FROM 2 CONFIG.DIN_TO 2 CONFIG.DIN_WIDTH 4} [get_bd_cells valid_slice_2]
create_bd_cell -type ip -vlnv xilinx.com:ip:xlslice:1.0 enable_slice_3
set_property -dict {CONFIG.DIN_FROM 3 CONFIG.DIN_TO 3 CONFIG.DIN_WIDTH 4} [get_bd_cells enable_slice_3]
create_bd_cell -type ip -vlnv xilinx.com:ip:xlslice:1.0 valid_slice_3
set_property -dict {CONFIG.DIN_FROM 3 CONFIG.DIN_TO 3 CONFIG.DIN_WIDTH 4} [get_bd_cells valid_slice_3]

# ---- hierarchy /axi_adrv9009_rx_jesd ----
current_bd_instance /axi_adrv9009_rx_jesd
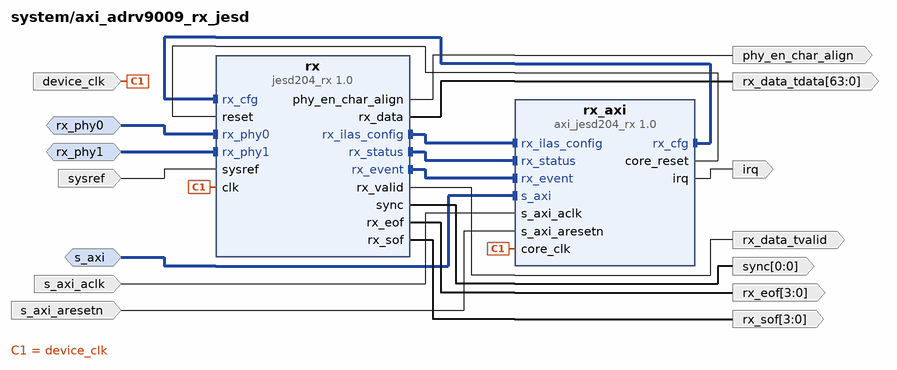
[diagram p8: block diagram inside /axi_adrv9009_rx_jesd]
create_bd_intf_pin -mode Slave -vlnv xilinx.com:interface:aximm_rtl:1.0 s_axi
create_bd_intf_pin -mode Slave -vlnv xilinx.com:display_jesd204:jesd204_rx_bus_rtl:1.0 rx_phy0
create_bd_intf_pin -mode Slave -vlnv xilinx.com:display_jesd204:jesd204_rx_bus_rtl:1.0 rx_phy1
create_bd_pin -dir I -type clk s_axi_aclk
create_bd_pin -dir I -type rst s_axi_aresetn
create_bd_pin -dir O -type intr irq
create_bd_pin -dir I -type clk device_clk
create_bd_pin -dir O -from 0 -to 0 sync
create_bd_pin -dir I sysref
create_bd_pin -dir O phy_en_char_align
create_bd_pin -dir O -from 3 -to 0 rx_eof
create_bd_pin -dir O -from 3 -to 0 rx_sof
create_bd_pin -dir O rx_data_tvalid
create_bd_pin -dir O -from 63 -to 0 rx_data_tdata

create_bd_cell -type ip -vlnv analog.com:user:axi_jesd204_rx:1.0 rx_axi
set_property -dict {CONFIG.NUM_LANES 2 CONFIG.NUM_LINKS 1} [get_bd_cells rx_axi]
create_bd_cell -type ip -vlnv analog.com:user:jesd204_rx:1.0 rx
set_property -dict {CONFIG.NUM_LANES 2 CONFIG.NUM_LINKS 1} [get_bd_cells rx]

# ---- hierarchy /rx_adrv9009_tpl_core ----
current_bd_instance /rx_adrv9009_tpl_core
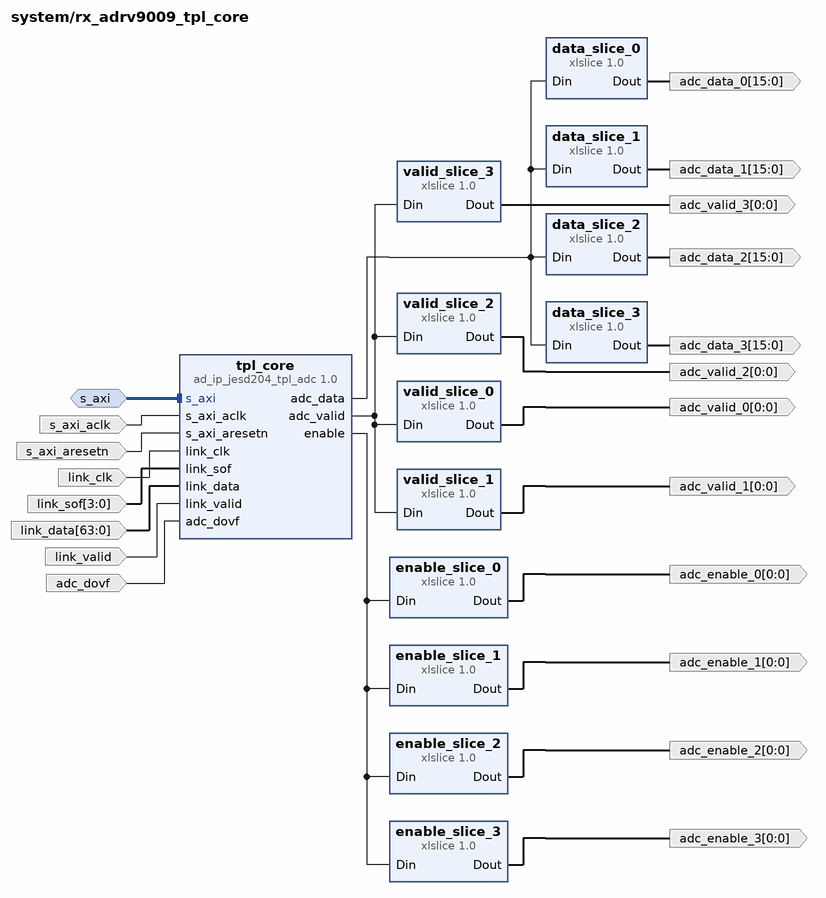
[diagram p9: block diagram inside /rx_adrv9009_tpl_core]
create_bd_intf_pin -mode Slave -vlnv xilinx.com:interface:aximm_rtl:1.0 s_axi
create_bd_pin -dir I -type clk s_axi_aclk
create_bd_pin -dir I -type rst s_axi_aresetn
create_bd_pin -dir I -type clk link_clk
create_bd_pin -dir I -from 3 -to 0 link_sof
create_bd_pin -dir I link_valid
create_bd_pin -dir I -from 63 -to 0 link_data
create_bd_pin -dir I adc_dovf
create_bd_pin -dir O -from 0 -to 0 adc_enable_0
create_bd_pin -dir O -from 0 -to 0 adc_valid_0
create_bd_pin -dir O -from 15 -to 0 adc_data_0
create_bd_pin -dir O -from 0 -to 0 adc_enable_1
create_bd_pin -dir O -from 0 -to 0 adc_valid_1
create_bd_pin -dir O -from 15 -to 0 adc_data_1
create_bd_pin -dir O -from 0 -to 0 adc_enable_2
create_bd_pin -dir O -from 0 -to 0 adc_valid_2
create_bd_pin -dir O -from 15 -to 0 adc_data_2
create_bd_pin -dir O -from 0 -to 0 adc_enable_3
create_bd_pin -dir O -from 0 -to 0 adc_valid_3
create_bd_pin -dir O -from 15 -to 0 adc_data_3

create_bd_cell -type ip -vlnv analog.com:user:ad_ip_jesd204_tpl_adc:1.0 tpl_core
set_property -dict [list \
  CONFIG.BITS_PER_SAMPLE 16 \
  CONFIG.CONVERTER_RESOLUTION 16 \
  CONFIG.NUM_CHANNELS 4 \
  CONFIG.NUM_LANES 2 \
  CONFIG.OCTETS_PER_BEAT 4 \
  CONFIG.SAMPLES_PER_FRAME 1 \
] [get_bd_cells tpl_core]
create_bd_cell -type ip -vlnv xilinx.com:ip:xlslice:1.0 data_slice_0
set_property -dict {CONFIG.DIN_FROM 15 CONFIG.DIN_TO 0 CONFIG.DIN_WIDTH 64} [get_bd_cells data_slice_0]
create_bd_cell -type ip -vlnv xilinx.com:ip:xlslice:1.0 enable_slice_0
set_property -dict {CONFIG.DIN_FROM 0 CONFIG.DIN_TO 0 CONFIG.DIN_WIDTH 4} [get_bd_cells enable_slice_0]
create_bd_cell -type ip -vlnv xilinx.com:ip:xlslice:1.0 valid_slice_0
set_property -dict {CONFIG.DIN_FROM 0 CONFIG.DIN_TO 0 CONFIG.DIN_WIDTH 4} [get_bd_cells valid_slice_0]
create_bd_cell -type ip -vlnv xilinx.com:ip:xlslice:1.0 data_slice_1
set_property -dict {CONFIG.DIN_FROM 31 CONFIG.DIN_TO 16 CONFIG.DIN_WIDTH 64} [get_bd_cells data_slice_1]
create_bd_cell -type ip -vlnv xilinx.com:ip:xlslice:1.0 enable_slice_1
set_property -dict {CONFIG.DIN_FROM 1 CONFIG.DIN_TO 1 CONFIG.DIN_WIDTH 4} [get_bd_cells enable_slice_1]
create_bd_cell -type ip -vlnv xilinx.com:ip:xlslice:1.0 valid_slice_1
set_property -dict {CONFIG.DIN_FROM 1 CONFIG.DIN_TO 1 CONFIG.DIN_WIDTH 4} [get_bd_cells valid_slice_1]
create_bd_cell -type ip -vlnv xilinx.com:ip:xlslice:1.0 data_slice_2
set_property -dict {CONFIG.DIN_FROM 47 CONFIG.DIN_TO 32 CONFIG.DIN_WIDTH 64} [get_bd_cells data_slice_2]
create_bd_cell -type ip -vlnv xilinx.com:ip:xlslice:1.0 enable_slice_2
set_property -dict {CONFIG.DIN_FROM 2 CONFIG.DIN_TO 2 CONFIG.DIN_WIDTH 4} [get_bd_cells enable_slice_2]
create_bd_cell -type ip -vlnv xilinx.com:ip:xlslice:1.0 valid_slice_2
set_property -dict {CONFIG.DIN_FROM 2 CONFIG.DIN_TO 2 CONFIG.DIN_WIDTH 4} [get_bd_cells valid_slice_2]
create_bd_cell -type ip -vlnv xilinx.com:ip:xlslice:1.0 data_slice_3
set_property -dict {CONFIG.DIN_FROM 63 CONFIG.DIN_TO 48 CONFIG.DIN_WIDTH 64} [get_bd_cells data_slice_3]
create_bd_cell -type ip -vlnv xilinx.com:ip:xlslice:1.0 enable_slice_3
set_property -dict {CONFIG.DIN_FROM 3 CONFIG.DIN_TO 3 CONFIG.DIN_WIDTH 4} [get_bd_cells enable_slice_3]
create_bd_cell -type ip -vlnv xilinx.com:ip:xlslice:1.0 valid_slice_3
set_property -dict {CONFIG.DIN_FROM 3 CONFIG.DIN_TO 3 CONFIG.DIN_WIDTH 4} [get_bd_cells valid_slice_3]

# ---- hierarchy /rx_fir_decimator ----
current_bd_instance /rx_fir_decimator
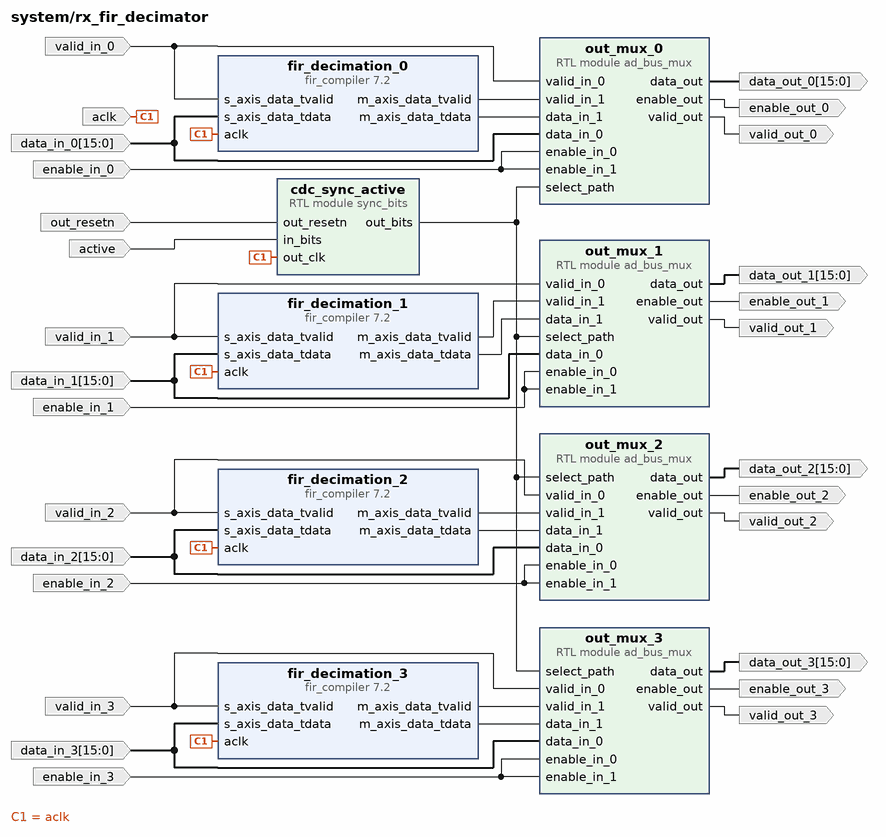
[diagram p10: block diagram inside /rx_fir_decimator]
create_bd_pin -dir I aclk
create_bd_pin -dir I active
create_bd_pin -dir I -type rst out_resetn
create_bd_pin -dir I valid_in_0
create_bd_pin -dir I enable_in_0
create_bd_pin -dir O valid_out_0
create_bd_pin -dir O enable_out_0
create_bd_pin -dir I -from 15 -to 0 data_in_0
create_bd_pin -dir O -from 15 -to 0 data_out_0
create_bd_pin -dir I valid_in_1
create_bd_pin -dir I enable_in_1
create_bd_pin -dir O valid_out_1
create_bd_pin -dir O enable_out_1
create_bd_pin -dir I -from 15 -to 0 data_in_1
create_bd_pin -dir O -from 15 -to 0 data_out_1
create_bd_pin -dir I valid_in_2
create_bd_pin -dir I enable_in_2
create_bd_pin -dir O valid_out_2
create_bd_pin -dir O enable_out_2
create_bd_pin -dir I -from 15 -to 0 data_in_2
create_bd_pin -dir O -from 15 -to 0 data_out_2
create_bd_pin -dir I valid_in_3
create_bd_pin -dir I enable_in_3
create_bd_pin -dir O valid_out_3
create_bd_pin -dir O enable_out_3
create_bd_pin -dir I -from 15 -to 0 data_in_3
create_bd_pin -dir O -from 15 -to 0 data_out_3

create_bd_cell -type module -reference sync_bits cdc_sync_active
create_bd_cell -type ip -vlnv xilinx.com:ip:fir_compiler:7.2 fir_decimation_0
set_property -dict [list \
  CONFIG.Clock_Frequency 122.88 \
  CONFIG.CoefficientSource COE_File \
  CONFIG.Coefficient_File ../../../../imports/hdl/library/util_fir_int/coefile_int.coe \
  CONFIG.Coefficient_Fractional_Bits 0 \
  CONFIG.Coefficient_Sets 1 \
  CONFIG.Coefficient_Sign Signed \
  CONFIG.Coefficient_Structure Inferred \
  CONFIG.Coefficient_Width 16 \
  CONFIG.ColumnConfig 9 \
  CONFIG.Data_Fractional_Bits 15 \
  CONFIG.Decimation_Rate 8 \
  CONFIG.Filter_Architecture Systolic_Multiply_Accumulate \
  CONFIG.Filter_Type Decimation \
  CONFIG.Interpolation_Rate 1 \
  CONFIG.Number_Channels 1 \
  CONFIG.Number_Paths 1 \
  CONFIG.Output_Rounding_Mode Symmetric_Rounding_to_Zero \
  CONFIG.Output_Width 16 \
  CONFIG.Quantization Integer_Coefficients \
  CONFIG.RateSpecification Frequency_Specification \
  CONFIG.Sample_Frequency 122.88 \
  CONFIG.Zero_Pack_Factor 1 \
] [get_bd_cells fir_decimation_0]
create_bd_cell -type module -reference ad_bus_mux out_mux_0
set_property -dict {CONFIG.DATA_WIDTH 16} [get_bd_cells out_mux_0]
create_bd_cell -type ip -vlnv xilinx.com:ip:fir_compiler:7.2 fir_decimation_1
set_property -dict [list \
  CONFIG.Clock_Frequency 122.88 \
  CONFIG.CoefficientSource COE_File \
  CONFIG.Coefficient_File ../../../../imports/hdl/library/util_fir_int/coefile_int.coe \
  CONFIG.Coefficient_Fractional_Bits 0 \
  CONFIG.Coefficient_Sets 1 \
  CONFIG.Coefficient_Sign Signed \
  CONFIG.Coefficient_Structure Inferred \
  CONFIG.Coefficient_Width 16 \
  CONFIG.ColumnConfig 9 \
  CONFIG.Data_Fractional_Bits 15 \
  CONFIG.Decimation_Rate 8 \
  CONFIG.Filter_Architecture Systolic_Multiply_Accumulate \
  CONFIG.Filter_Type Decimation \
  CONFIG.Interpolation_Rate 1 \
  CONFIG.Number_Channels 1 \
  CONFIG.Number_Paths 1 \
  CONFIG.Output_Rounding_Mode Symmetric_Rounding_to_Zero \
  CONFIG.Output_Width 16 \
  CONFIG.Quantization Integer_Coefficients \
  CONFIG.RateSpecification Frequency_Specification \
  CONFIG.Sample_Frequency 122.88 \
  CONFIG.Zero_Pack_Factor 1 \
] [get_bd_cells fir_decimation_1]
create_bd_cell -type module -reference ad_bus_mux out_mux_1
set_property -dict {CONFIG.DATA_WIDTH 16} [get_bd_cells out_mux_1]
create_bd_cell -type ip -vlnv xilinx.com:ip:fir_compiler:7.2 fir_decimation_2
set_property -dict [list \
  CONFIG.Clock_Frequency 122.88 \
  CONFIG.CoefficientSource COE_File \
  CONFIG.Coefficient_File ../../../../imports/hdl/library/util_fir_int/coefile_int.coe \
  CONFIG.Coefficient_Fractional_Bits 0 \
  CONFIG.Coefficient_Sets 1 \
  CONFIG.Coefficient_Sign Signed \
  CONFIG.Coefficient_Structure Inferred \
  CONFIG.Coefficient_Width 16 \
  CONFIG.ColumnConfig 9 \
  CONFIG.Data_Fractional_Bits 15 \
  CONFIG.Decimation_Rate 8 \
  CONFIG.Filter_Architecture Systolic_Multiply_Accumulate \
  CONFIG.Filter_Type Decimation \
  CONFIG.Interpolation_Rate 1 \
  CONFIG.Number_Channels 1 \
  CONFIG.Number_Paths 1 \
  CONFIG.Output_Rounding_Mode Symmetric_Rounding_to_Zero \
  CONFIG.Output_Width 16 \
  CONFIG.Quantization Integer_Coefficients \
  CONFIG.RateSpecification Frequency_Specification \
  CONFIG.Sample_Frequency 122.88 \
  CONFIG.Zero_Pack_Factor 1 \
] [get_bd_cells fir_decimation_2]
create_bd_cell -type module -reference ad_bus_mux out_mux_2
set_property -dict {CONFIG.DATA_WIDTH 16} [get_bd_cells out_mux_2]
create_bd_cell -type ip -vlnv xilinx.com:ip:fir_compiler:7.2 fir_decimation_3
set_property -dict [list \
  CONFIG.Clock_Frequency 122.88 \
  CONFIG.CoefficientSource COE_File \
  CONFIG.Coefficient_File ../../../../imports/hdl/library/util_fir_int/coefile_int.coe \
  CONFIG.Coefficient_Fractional_Bits 0 \
  CONFIG.Coefficient_Sets 1 \
  CONFIG.Coefficient_Sign Signed \
  CONFIG.Coefficient_Structure Inferred \
  CONFIG.Coefficient_Width 16 \
  CONFIG.ColumnConfig 9 \
  CONFIG.Data_Fractional_Bits 15 \
  CONFIG.Decimation_Rate 8 \
  CONFIG.Filter_Architecture Systolic_Multiply_Accumulate \
  CONFIG.Filter_Type Decimation \
  CONFIG.Interpolation_Rate 1 \
  CONFIG.Number_Channels 1 \
  CONFIG.Number_Paths 1 \
  CONFIG.Output_Rounding_Mode Symmetric_Rounding_to_Zero \
  CONFIG.Output_Width 16 \
  CONFIG.Quantization Integer_Coefficients \
  CONFIG.RateSpecification Frequency_Specification \
  CONFIG.Sample_Frequency 122.88 \
  CONFIG.Zero_Pack_Factor 1 \
] [get_bd_cells fir_decimation_3]
create_bd_cell -type module -reference ad_bus_mux out_mux_3
set_property -dict {CONFIG.DATA_WIDTH 16} [get_bd_cells out_mux_3]
